# EasyEDA Pro project ProPrj_hdmi_3in1out_2024-07-09.epro

# Schematic SCH_hdmi_3in1out
Create Date: 2024-07-02; Page Name: P1; Project Name: hdmi_3in1out; Schematic Name: SCH_hdmi_3in1out; Update Date: 2024-07-04; Company: 8144623A; Page Size: A3
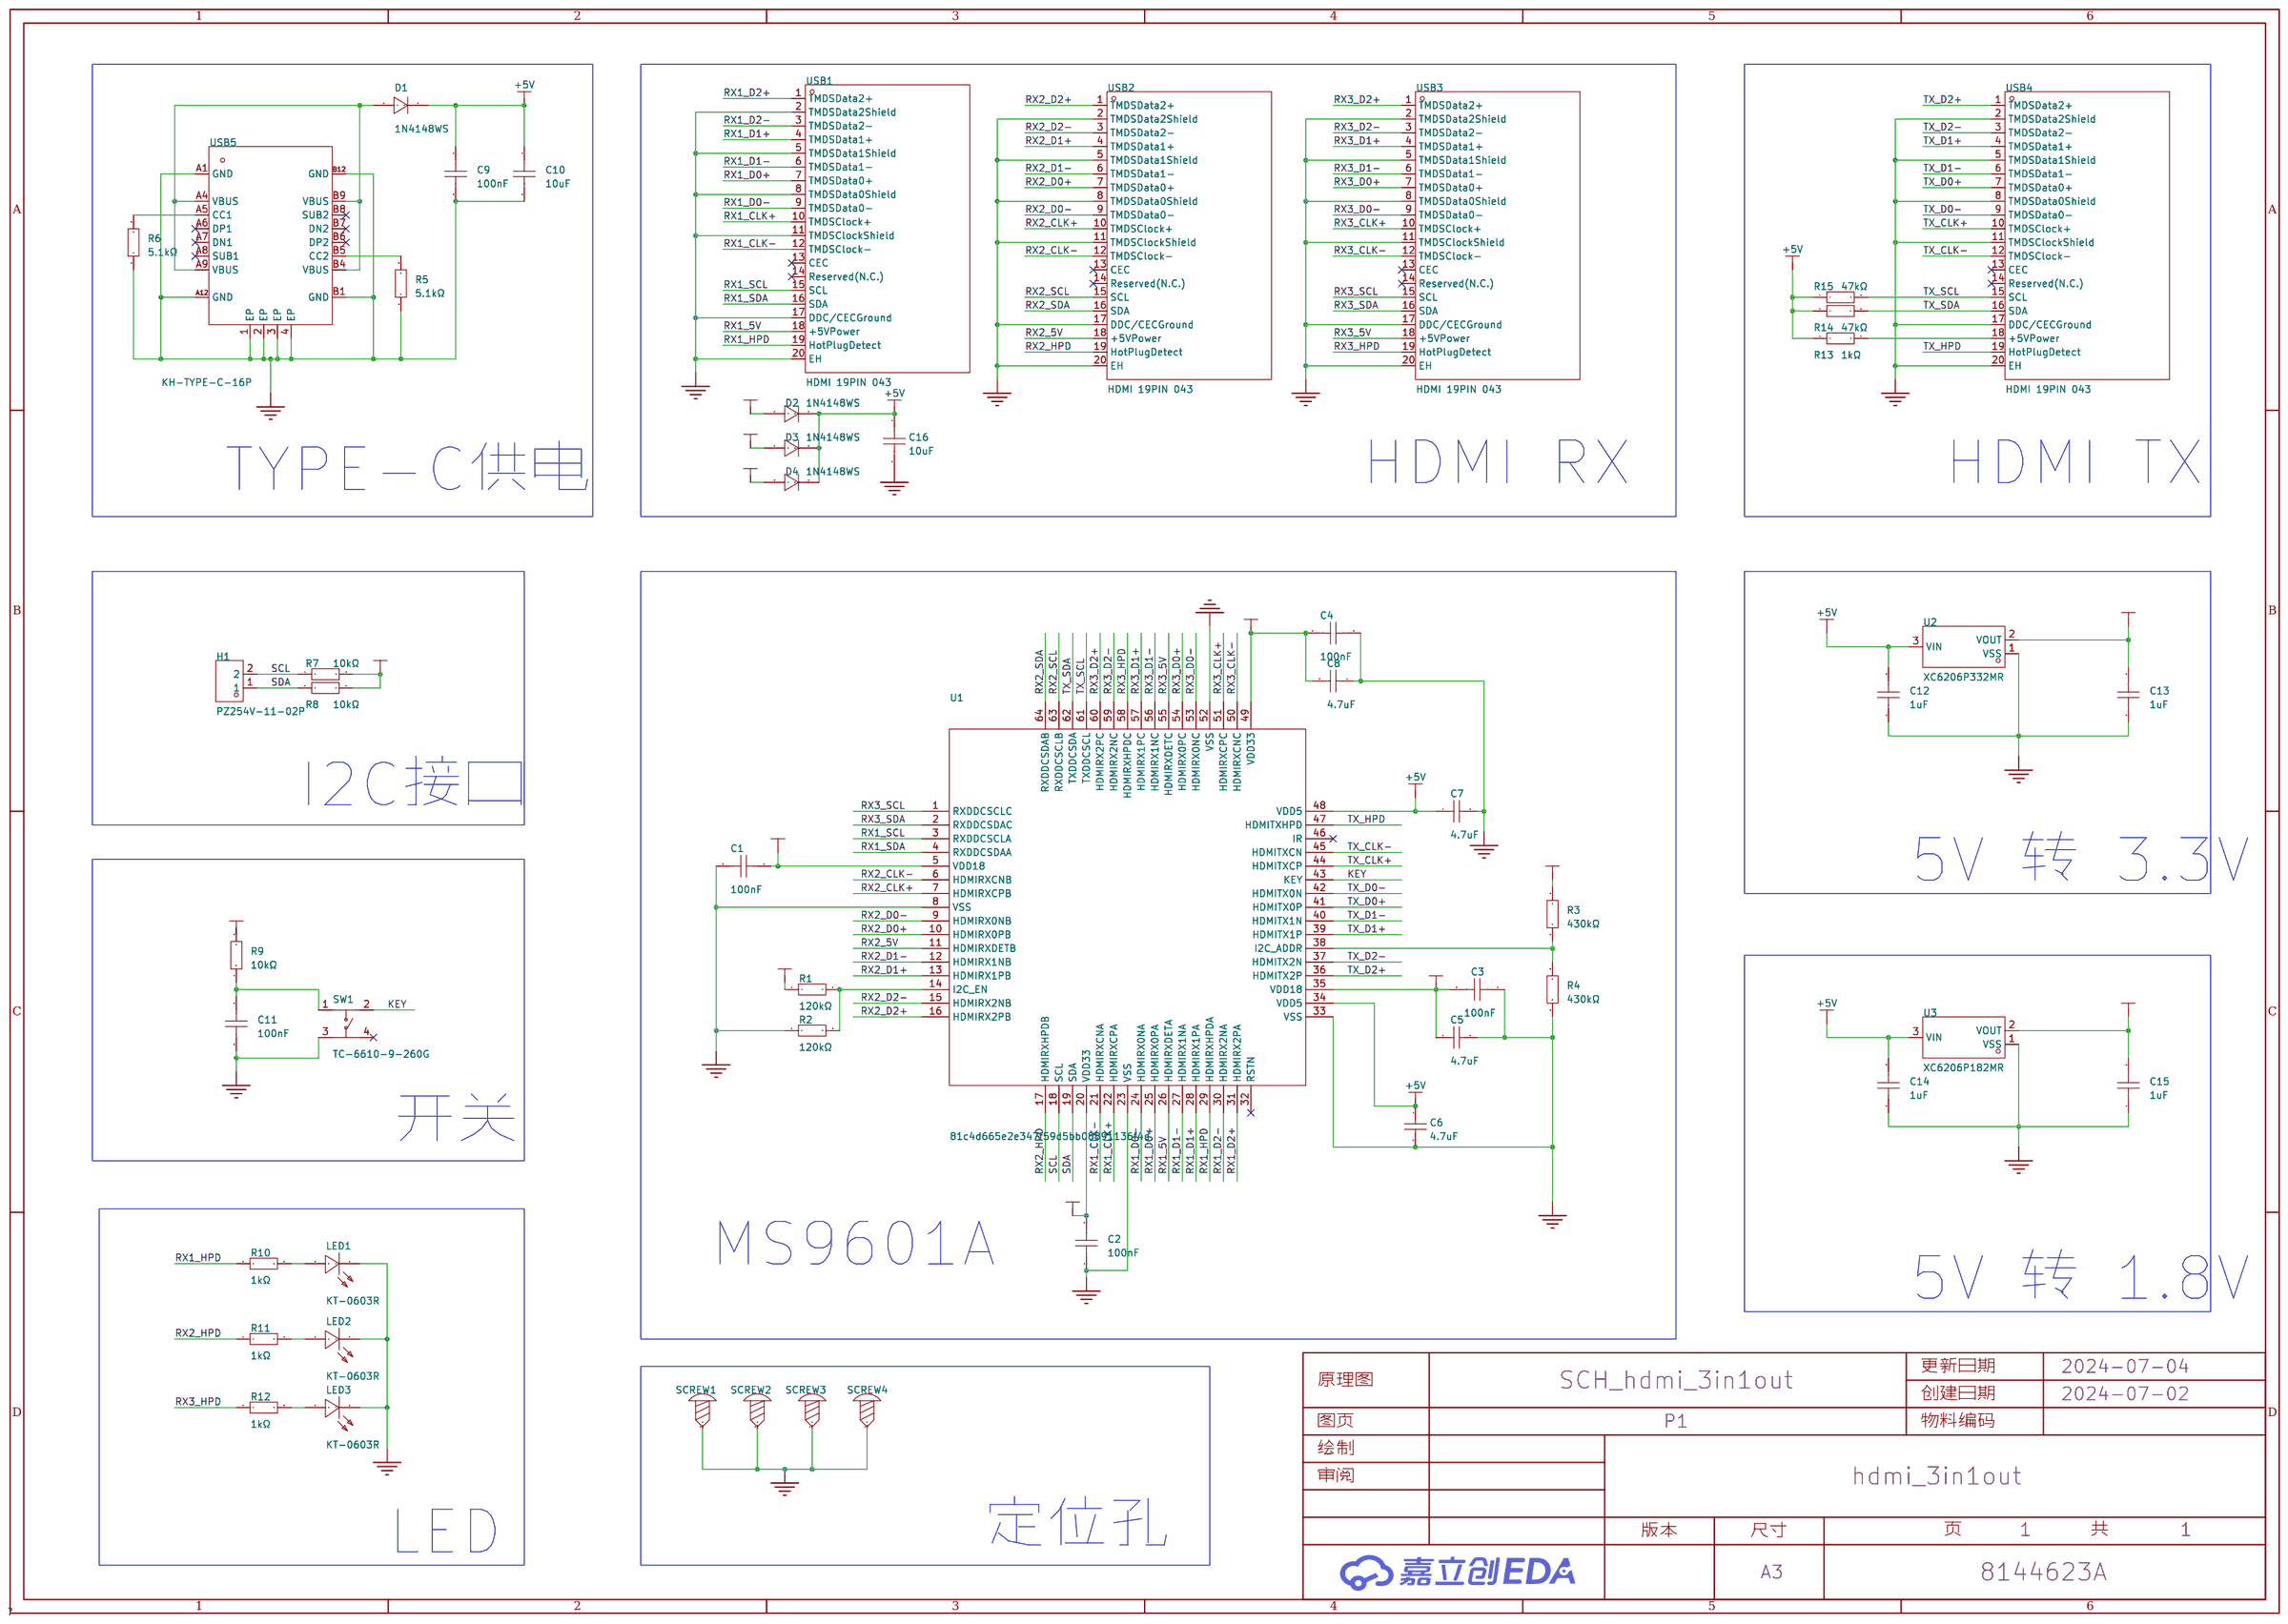
[diagram p0: schematic sheet]

## Parts
C1  100nF  [C0603]
C2  100nF  [C0603]
C3  100nF  [C0603]
C4  100nF  [C0603]
C5  4.7uF  [C0603]
C6  4.7uF  [C0603]
C7  4.7uF  [C0603]
C8  4.7uF  [C0603]
C9  100nF  [C0603]
C10  10uF  [C0603]
C11  100nF  [C0603]
C12  1uF  [C0603]
C13  1uF  [C0603]
C14  1uF  [C0603]
C15  1uF  [C0603]
C16  10uF  [C0603]
D1  1N4148WS  [SOD-323_L1.8-W1.3-LS2.5-RD]
D2  1N4148WS  [SOD-323_L1.8-W1.3-LS2.5-RD]
D3  1N4148WS  [SOD-323_L1.8-W1.3-LS2.5-RD]
D4  1N4148WS  [SOD-323_L1.8-W1.3-LS2.5-RD]
H1  PZ254V-11-02P  [HDR-TH_2P-P2.54-V-M]
LED1  KT-0603R  [LED0603-RD]
LED2  KT-0603R  [LED0603-RD]
LED3  KT-0603R  [LED0603-RD]
R1  120kΩ  [R0603]
R2  120kΩ  [R0603]
R3  430kΩ  [R0603]
R4  430kΩ  [R0603]
R5  5.1kΩ  [R0603]
R6  5.1kΩ  [R0603]
R7  10kΩ  [R0603]
R8  10kΩ  [R0603]
R9  10kΩ  [R0603]
R10  1kΩ  [R0603]
R11  1kΩ  [R0603]
R12  1kΩ  [R0603]
R13  1kΩ  [R0603]
R14  47kΩ  [R0603]
R15  47kΩ  [R0603]
SCREW1  -  [M3螺丝]
SCREW2  -  [M3螺丝]
SCREW3  -  [M3螺丝]
SCREW4  -  [M3螺丝]
SW1  TC-6610-9-260G  [SW-TH_4P-L5.0-W5.0-P4.50-LS6.5]
U1  81c4d665e2e347f59d5bb08891136f4d  [LQFP-64_L10.0-W10.0-P0.50-LS12.0-TL]
U2  XC6206P332MR  [SOT-23-3_L3.0-W1.7-P0.95-LS2.9-BR]
U3  XC6206P182MR  [SOT-23-3_L3.0-W1.7-P0.95-LS2.9-BR]
USB1  HDMI 19PIN 043  [HDMI-SMD_HDMI-19PIN-043]
USB2  HDMI 19PIN 043  [HDMI-SMD_HDMI-19PIN-043]
USB3  HDMI 19PIN 043  [HDMI-SMD_HDMI-19PIN-043]
USB4  HDMI 19PIN 043  [HDMI-SMD_HDMI-19PIN-043]
USB5  KH-TYPE-C-16P  [USB-C-SMD_KH-TYPE-C-16P]

## Library data of the parts
C1-C4 C9 C11 = CC0603KRX7R9BB104: 容值:100nF;精度:±10%;额定电压:50V;材质(温度系数):X7R;; LCSC Part Name: 100nF ±10% 50V; Supplier Part: C14663; Manufacturer: YAGEO(国巨); Supplier Footprint: 0603; JLCPCB Part Class: 基础库; Datasheet: https://atta.szlcsc.com/upload/public/pdf/source/20180910/C282072_33301C7F631E79921B82A8DAC6BCC5B3.pdf; Supplier: LCSC; Tolerance: ±10%; Voltage Rated: 50V; Temperature Coefficient: X7R
C5-C8 = CL10A475KO8NNNC: 容值:4.7uF;精度:±10%;额定电压:16V;材质(温度系数):X5R;; LCSC Part Name: 4.7uF ±10% 16V; Supplier Part: C19666; Manufacturer: SAMSUNG(三星); Supplier Footprint: 0603; JLCPCB Part Class: 基础库; Datasheet: https://atta.szlcsc.com/upload/public/pdf/source/20160218/1457707763339.pdf; Supplier: LCSC; Tolerance: ±10%; Voltage Rated: 16V; Temperature Coefficient: X5R
C10 C16 = CL10A106KP8NNNC: 容值:10uF;精度:±10%;额定电压:10V;材质(温度系数):X5R;; LCSC Part Name: 10uF ±10% 10V; Supplier Part: C19702; Manufacturer: SAMSUNG(三星); Supplier Footprint: 0603; JLCPCB Part Class: 基础库; Datasheet: https://atta.szlcsc.com/upload/public/pdf/source/20160218/1457707763339.pdf; Supplier: LCSC; Tolerance: ±10%; Voltage Rated: 10V; Temperature Coefficient: X5R
C12-C15 = CL10A105KB8NNNC: 容值:1uF;精度:±10%;额定电压:50V;材质(温度系数):X5R;; LCSC Part Name: 1uF ±10% 50V; Supplier Part: C15849; Manufacturer: SAMSUNG(三星); Supplier Footprint: 0603; JLCPCB Part Class: 基础库; Datasheet: https://atta.szlcsc.com/upload/public/pdf/source/20160218/1457707763339.pdf; Supplier: LCSC; Tolerance: ±10%; Voltage Rated: 50V; Temperature Coefficient: X5R
D1-D4 = 1N4148WS_C2128: 二极管配置:独立式;正向压降(Vf):1.25V@150mA;直流反向耐压(Vr):100V;平均整流电流(Io):150mA;功率:200mW;反向恢复时间(trr):4ns;; LCSC Part Name: 电压:100V 电流:150mA; Supplier Part: C2128; Manufacturer: CJ(江苏长电/长晶); Supplier Footprint: SOD-323; JLCPCB Part Class: 基础库; Datasheet: https://atta.szlcsc.com/upload/public/pdf/source/20140809/1457707208178.pdf; Supplier: LCSC; Diode Configuration: 独立式; Forward Voltage (Vf@If): 1.25V@150mA; Reverse Voltage (Vr): 100V; Average Rectified Current (Io): 150mA; Power Dissipation: 200mW; Reverse Leakage Current: 1uA@75V; Reverse Recovery Time (trr): 4ns
H1 = PZ254V-11-02P: 插针结构:1x2P;间距:2.54mm;行距:-;圆针/方针:方针;安装类型:直插;排数:单排;总PIN位数:2P;额定电流:-;额定电压:-;配合针长度:6mm;塑高:2.5mm;端接针长度:3mm;触头材质:黄铜;触头镀层:-;工作温度范围:-40℃~+105℃;颜色:黑色;; LCSC Part Name: 间距:2.54mm 1x2P 直插 方针; Supplier Part: C492401; Manufacturer: XFCN(兴飞); Supplier Footprint: 插件,P=2.54mm; JLCPCB Part Class: 扩展库; Datasheet: https://atta.szlcsc.com/upload/public/pdf/source/20200309/C492401_A812433581A9B211A7FFA413ADDFF0E5.pdf; Supplier: LCSC; Pin Structure: 1x2P; Pitch: 2.54mm; Circluar Pins/Square Pins: 方针; Mounting Type: 直插; Number of Rows: 单排; Number of Pins: 2P; Length of Mating Pin: 6mm; Insulation Height: 2.5mm; Length of End Connection Pin: 3mm; Contact Material: 黄铜; Operating Temperature Range: -40℃~+105℃; Color: 黑色
LED1-LED3 = KT-0603R: 发光颜色:红色;功率:-;正向电流:-;主波长:-;二极管配置:-;透镜颜色:-;色温:-;发光角度:-;载带方式:-;工作温度:-40℃~+85℃;; LCSC Part Name: 0603 红灯 高亮; Supplier Part: C2286; Manufacturer: KENTO; Supplier Footprint: 0603; JLCPCB Part Class: 基础库; Datasheet: https://atta.szlcsc.com/upload/public/pdf/source/20160616/1466072038404.pdf; Supplier: LCSC; Emitted Color: 红色; Operating Temperature: -40℃~+85℃
R1 R2 = 0603WAF1203T5E: 电阻类型:厚膜电阻;阻值:120kΩ;精度:±1%;功率:100mW;最大工作电压:75V;温度系数:±100ppm/℃;; LCSC Part Name: 120kΩ ±1% 100mW 厚膜电阻; Supplier Part: C25808; Manufacturer: UNI-ROYAL(厚声); Supplier Footprint: 0603; JLCPCB Part Class: 基础库; Datasheet: https://atta.szlcsc.com/upload/public/pdf/source/20200306/C422600_1E6D84923E4A46A82E41ADD87F860B5C.pdf; Supplier: LCSC; Type: 厚膜电阻; Tolerance: ±1%; Power(Watts): 100mW; Overload Voltage (Max): 75V; Temperature Coefficient: ±100ppm/℃; Operating Temperature Range: -55℃~+155℃
R3 R4 = AC0603FR-07430KL: 电阻类型:厚膜电阻;阻值:430kΩ;精度:±1%;功率:100mW;最大工作电压:75V;温度系数:±100ppm/℃;; LCSC Part Name: 厚膜电阻 430kΩ ±1% 100mW; Supplier Part: C227898; Manufacturer: YAGEO(国巨); Supplier Footprint: 0603; JLCPCB Part Class: 扩展库; Datasheet: https://atta.szlcsc.com/upload/public/pdf/source/20190107/C227898_FC1AF90E076E0DD6993EF8ADE20BB417.pdf; Supplier: LCSC; Type: 厚膜电阻; Tolerance: ±1%; Power(Watts): 100mW; Overload Voltage (Max): 75V; Temperature Coefficient: ±100ppm/℃; Operating Temperature Range: -55℃~+155℃
R5 R6 = 0603WAF5101T5E: 电阻类型:厚膜电阻;阻值:5.1kΩ;精度:±1%;功率:100mW;最大工作电压:75V;温度系数:±100ppm/℃;; LCSC Part Name: 5.1kΩ ±1% 100mW 厚膜电阻; Supplier Part: C23186; Manufacturer: UNI-ROYAL(厚声); Supplier Footprint: 0603; JLCPCB Part Class: 基础库; Datasheet: https://atta.szlcsc.com/upload/public/pdf/source/20200306/C422600_1E6D84923E4A46A82E41ADD87F860B5C.pdf; Supplier: LCSC; Type: 厚膜电阻; Tolerance: ±1%; Power(Watts): 100mW; Overload Voltage (Max): 75V; Temperature Coefficient: ±100ppm/℃; Operating Temperature Range: -55℃~+155℃
R7-R9 = 0603WAF1002T5E: 电阻类型:厚膜电阻;阻值:10kΩ;精度:±1%;功率:100mW;最大工作电压:75V;温度系数:±100ppm/℃;; LCSC Part Name: 厚膜电阻 10kΩ ±1% 100mW; Supplier Part: C25804; Manufacturer: UNI-ROYAL(厚声); Supplier Footprint: 0603; JLCPCB Part Class: 基础库; Datasheet: https://atta.szlcsc.com/upload/public/pdf/source/20200306/C422600_1E6D84923E4A46A82E41ADD87F860B5C.pdf; Supplier: LCSC; Type: 厚膜电阻; Tolerance: ±1%; Power(Watts): 100mW; Overload Voltage (Max): 75V; Temperature Coefficient: ±100ppm/℃; Operating Temperature Range: -55℃~+155℃
R10-R13 = 0603WAF1001T5E: 电阻类型:厚膜电阻;阻值:1kΩ;精度:±1%;功率:100mW;最大工作电压:75V;温度系数:±100ppm/℃;; LCSC Part Name: 1kΩ ±1% 100mW 厚膜电阻; Supplier Part: C21190; Manufacturer: UNI-ROYAL(厚声); Supplier Footprint: 0603; JLCPCB Part Class: 基础库; Datasheet: https://atta.szlcsc.com/upload/public/pdf/source/20200306/C422600_1E6D84923E4A46A82E41ADD87F860B5C.pdf; Supplier: LCSC; Type: 厚膜电阻; Tolerance: ±1%; Power(Watts): 100mW; Overload Voltage (Max): 75V; Temperature Coefficient: ±100ppm/℃; Operating Temperature Range: -55℃~+155℃
R14 R15 = 0603WAF4702T5E: 电阻类型:厚膜电阻;阻值:47kΩ;精度:±1%;功率:100mW;最大工作电压:75V;温度系数:±100ppm/℃;; LCSC Part Name: 47kΩ ±1% 100mW 厚膜电阻; Supplier Part: C25819; Manufacturer: UNI-ROYAL(厚声); Supplier Footprint: 0603; JLCPCB Part Class: 基础库; Datasheet: https://atta.szlcsc.com/upload/public/pdf/source/20200306/C422600_1E6D84923E4A46A82E41ADD87F860B5C.pdf; Supplier: LCSC; Type: 厚膜电阻; Tolerance: ±1%; Power(Watts): 100mW; Overload Voltage (Max): 75V; Temperature Coefficient: ±100ppm/℃; Operating Temperature Range: -55℃~+155℃
SCREW1-SCREW4 = M3螺丝: Supplier Footprint: 插件
SW1 = TC-6610-9-260G: 电路结构:单刀单掷;按钮形状:-;作用力:260gf;安装方式:直插;开关长度:6mm;开关宽度:6mm;开关高度:9mm;带支架:-;触点电流:50mA;额定电压(AC):-;额定电压(DC):12V;额定功率:-;绝缘电阻:100MΩ;带灯:-;机械寿命:10万次;; LCSC Part Name: 6*6*9mm 立贴 轻触开关; Supplier Part: C2845257; Manufacturer: HCTL(华灿天禄); Supplier Footprint: 插件; JLCPCB Part Class: 扩展库; Datasheet: https://atta.szlcsc.com/upload/public/pdf/source/20230323/2FDB5D6FCE87B7593CD3E5FAC75F65D7.pdf; Supplier: LCSC; Circuit: 单刀单掷; Operating Force: 260gf; Mounting Style: 直插; Switch Length: 6mm; Switch Width: 6mm; Switch Height: 9mm; Contact Current: 50mA; Voltage Rating (DC): 12V; Insulation Resistance: 100MΩ; Mechanical Life: 10万次
U1 = MS9601A
U2 = XC6206P332MR_C347376: 输出类型:固定;最大输入电压:8V;输出电压:3.3V;最大输出电流:250mA;电源纹波抑制比(PSRR):40dB@(1kHz);输出极性:正极;; LCSC Part Name: 输入8V 输出3.3V 250mA; Supplier Part: C347376; Manufacturer: UMW(友台半导体); Supplier Footprint: SOT-23; JLCPCB Part Class: 扩展库; Datasheet: https://atta.szlcsc.com/upload/public/pdf/source/20231109/6B10DA60E52FC900BF97E3EFEB5D6341.pdf; Supplier: LCSC; Output Type: 固定; Maximum Input Voltage: 8V; Output Voltage: 3.3V; MAX Output Current: 250mA; Power Supply Rejection Ratio (PSRR): 40dB@(1kHz); Dropout Voltage: 240mV@(50mA); Operating Temperature: -25℃~+80℃; Output Polarity: 正极; Number of Outputs: 1
U3 = XC6206P182MR_C347373: 输出类型:固定;最大输入电压:8V;输出电压:1.8V;最大输出电流:250mA;电源纹波抑制比(PSRR):40dB@(1kHz);输出极性:正极;; LCSC Part Name: 输入8V 输出1.8V 250mA; Supplier Part: C347373; Manufacturer: UMW(友台半导体); Supplier Footprint: SOT-23; JLCPCB Part Class: 扩展库; Datasheet: https://atta.szlcsc.com/upload/public/pdf/source/20231109/6B10DA60E52FC900BF97E3EFEB5D6341.pdf; Supplier: LCSC; Output Type: 固定; Maximum Input Voltage: 8V; Output Voltage: 1.8V; MAX Output Current: 250mA; Power Supply Rejection Ratio (PSRR): 40dB@(1kHz); Dropout Voltage: 280mV@(50mA); Output Polarity: 正极; Number of Outputs: 1
USB1-USB4 = HDMI 19PIN 043: 连接器类型:HDMI;公母:母;总PIN位数:19P;安装方式:卧贴;排数:-;额定电流:300mA;工作温度范围:-55℃~+85℃;; LCSC Part Name: HDMI 母 P数:19P; Supplier Part: C2858275; Manufacturer: SHOU HAN(首韩); Supplier Footprint: SMD; JLCPCB Part Class: 扩展库; Datasheet: https://atta.szlcsc.com/upload/public/pdf/source/20210728/C2858275_DF299413048A9CF092C2A61AB97004F4.pdf; Supplier: LCSC; Connector Type: HDMI; Gender: 母; Number of Pins: 19P; Mounting Style: 卧贴; Current Rating (Max): 300mA; Operating Temperature Range: -55℃~+85℃
USB5 = KH-TYPE-C-16P: 连接器类型:Type-C;标准:-;公母:母;端口数量:1;触点数量:16P;安装方式:卧贴;额定电流 - 电源:3A;工作温度范围:-40℃~+85℃;; LCSC Part Name: Type-C 母 卧贴; Supplier Part: C709357; Manufacturer: kinghelm(金航标); Supplier Footprint: SMD; JLCPCB Part Class: 扩展库; Datasheet: https://atta.szlcsc.com/upload/public/pdf/source/20200911/C709357_AA8DCEB38BB20E3035A7ED7AE7667837.pdf; Supplier: LCSC; Connector Type: Type-C; Gender: 母; Number of Ports: 1; Number of Contacts: 16P; Mounting Style: 卧贴; Current Rating - Power (Max): 3A; Operating Temperature Range: -40℃~+85℃

## Nets
1.8V: C1.1 C3.2 C5.1 C15.2 U1.5(VDD18) U1.35(VDD18) U3.2(VOUT)
3.3V: C2.2 C4.1 C8.2 C13.2 R1.1 R3.2 R7.2 R8.2 R9.2 U1.20(VDD33) U1.49(VDD33) U2.2(VOUT)
+5V: C6.1 C7.1 C9.1 C10.1 C12.2 C14.2 C16.1 D1.1(K) D2.1(K) D3.1(K) D4.1(K) R13.1 R14.1 R15.1 U1.34(VDD5) U1.48(VDD5) U2.3(VIN) U3.3(VIN)
GND: C1.2 C2.1 C3.1 C4.2 C5.2 C6.2 C7.2 C8.1 C9.2 C10.2 C11.2 C12.1 C13.1 C14.1 C15.1 C16.2 LED1.1(K) LED2.1(K) LED3.1(K) R2.1 R4.1 R5.1 R6.1 SCREW1.1 SCREW2.1 SCREW3.1 SCREW4.1 SW1.3 U1.8(VSS) U1.23(VSS) U1.33(VSS) U1.52(VSS) U2.1(VSS) U3.1(VSS) USB1.2(TMDSData2Shield) USB1.5(TMDSData1Shield) USB1.8(TMDSData0Shield) USB1.11(TMDSClockShield) USB1.17(DDC/CECGround) USB1.20(EH) USB2.2(TMDSData2Shield) USB2.5(TMDSData1Shield) USB2.8(TMDSData0Shield) USB2.11(TMDSClockShield) USB2.17(DDC/CECGround) USB2.20(EH) USB3.2(TMDSData2Shield) USB3.5(TMDSData1Shield) USB3.8(TMDSData0Shield) USB3.11(TMDSClockShield) USB3.17(DDC/CECGround) USB3.20(EH) USB4.2(TMDSData2Shield) USB4.5(TMDSData1Shield) USB4.8(TMDSData0Shield) USB4.11(TMDSClockShield) USB4.17(DDC/CECGround) USB4.20(EH) USB5.1(EP) USB5.2(EP) USB5.3(EP) USB5.4(EP) USB5.A1(GND) USB5.A12(GND) USB5.B1(GND) USB5.B12(GND)
KEY: SW1.2 U1.43(KEY)
RX1_5V: D2.2(A) U1.26(HDMIRXDETA) USB1.18(+5VPower)
RX1_CLK+: U1.22(HDMIRXCPA) USB1.10(TMDSClock+)
RX1_CLK-: U1.21(HDMIRXCNA) USB1.12(TMDSClock-)
RX1_D0+: U1.25(HDMIRX0PA) USB1.7(TMDSData0+)
RX1_D0-: U1.24(HDMIRX0NA) USB1.9(TMDSData0-)
RX1_D1+: U1.28(HDMIRX1PA) USB1.4(TMDSData1+)
RX1_D1-: U1.27(HDMIRX1NA) USB1.6(TMDSData1-)
RX1_D2+: U1.31(HDMIRX2PA) USB1.1(TMDSData2+)
RX1_D2-: U1.30(HDMIRX2NA) USB1.3(TMDSData2-)
RX1_HPD: R10.1 U1.29(HDMIRXHPDA) USB1.19(HotPlugDetect)
RX1_SCL: U1.3(RXDDCSCLA) USB1.15(SCL)
RX1_SDA: U1.4(RXDDCSDAA) USB1.16(SDA)
RX2_5V: D3.2(A) U1.11(HDMIRXDETB) USB2.18(+5VPower)
RX2_CLK+: U1.7(HDMIRXCPB) USB2.10(TMDSClock+)
RX2_CLK-: U1.6(HDMIRXCNB) USB2.12(TMDSClock-)
RX2_D0+: U1.10(HDMIRX0PB) USB2.7(TMDSData0+)
RX2_D0-: U1.9(HDMIRX0NB) USB2.9(TMDSData0-)
RX2_D1+: U1.13(HDMIRX1PB) USB2.4(TMDSData1+)
RX2_D1-: U1.12(HDMIRX1NB) USB2.6(TMDSData1-)
RX2_D2+: U1.16(HDMIRX2PB) USB2.1(TMDSData2+)
RX2_D2-: U1.15(HDMIRX2NB) USB2.3(TMDSData2-)
RX2_HPD: R11.1 U1.17(HDMIRXHPDB) USB2.19(HotPlugDetect)
RX2_SCL: U1.63(RXDDCSCLB) USB2.15(SCL)
RX2_SDA: U1.64(RXDDCSDAB) USB2.16(SDA)
RX3_5V: D4.2(A) U1.55(HDMIRXDETC) USB3.18(+5VPower)
RX3_CLK+: U1.51(HDMIRXCPC) USB3.10(TMDSClock+)
RX3_CLK-: U1.50(HDMIRXCNC) USB3.12(TMDSClock-)
RX3_D0+: U1.54(HDMIRX0PC) USB3.7(TMDSData0+)
RX3_D0-: U1.53(HDMIRX0NC) USB3.9(TMDSData0-)
RX3_D1+: U1.57(HDMIRX1PC) USB3.4(TMDSData1+)
RX3_D1-: U1.56(HDMIRX1NC) USB3.6(TMDSData1-)
RX3_D2+: U1.60(HDMIRX2PC) USB3.1(TMDSData2+)
RX3_D2-: U1.59(HDMIRX2NC) USB3.3(TMDSData2-)
RX3_HPD: R12.1 U1.58(HDMIRXHPDC) USB3.19(HotPlugDetect)
RX3_SCL: U1.1(RXDDCSCLC) USB3.15(SCL)
RX3_SDA: U1.2(RXDDCSDAC) USB3.16(SDA)
SCL: H1.2 R7.1 U1.18(SCL)
SDA: H1.1 R8.1 U1.19(SDA)
TX_CLK+: U1.44(HDMITXCP) USB4.10(TMDSClock+)
TX_CLK-: U1.45(HDMITXCN) USB4.12(TMDSClock-)
TX_D0+: U1.41(HDMITX0P) USB4.7(TMDSData0+)
TX_D0-: U1.42(HDMITX0N) USB4.9(TMDSData0-)
TX_D1+: U1.39(HDMITX1P) USB4.4(TMDSData1+)
TX_D1-: U1.40(HDMITX1N) USB4.6(TMDSData1-)
TX_D2+: U1.36(HDMITX2P) USB4.1(TMDSData2+)
TX_D2-: U1.37(HDMITX2N) USB4.3(TMDSData2-)
TX_HPD: U1.47(HDMITXHPD) USB4.19(HotPlugDetect)
TX_SCL: R15.2 U1.61(TXDDCSCL) USB4.15(SCL)
TX_SDA: R14.2 U1.62(TXDDCSDA) USB4.16(SDA)
$1N1487: R1.2 R2.2 U1.14(I2C_EN)
$1N1687: R3.1 R4.2 U1.38(I2C_ADDR)
$1N4048: R5.2 USB5.B5(CC2)
$1N4076: R6.2 USB5.A5(CC1)
$1N4174: D1.2(A) USB5.A4(VBUS) USB5.A9(VBUS) USB5.B4(VBUS) USB5.B9(VBUS)
$1N5209: C11.1 R9.1 SW1.1
$1N5577: LED1.2(A) R10.2
$1N5615: LED3.2(A) R12.2
$1N5620: LED2.2(A) R11.2
$1N6792: R13.2 USB4.18(+5VPower)

Not connected (* = marked no-connect by the designer): SW1 4*; U1 32(RSTN)* 46(IR)*; USB1 13(CEC)* 14(Reserved(N.C.))*; USB2 13(CEC)* 14(Reserved(N.C.))*; USB3 13(CEC)* 14(Reserved(N.C.))*; USB4 13(CEC)* 14(Reserved(N.C.))*; USB5 A6(DP1)* A7(DN1)* A8(SUB1)* B6(DP2)* B7(DN2)* B8(SUB2)*

## Notes on the sheet
- TYPE-C供电
- HDMI RX
- HDMI TX
- I2C接口
- 5V 转 3.3V
- 开关
- MS9601A
- 5V 转 1.8V
- 定位孔
- LED

# Board PCB_hdmi_3in1out
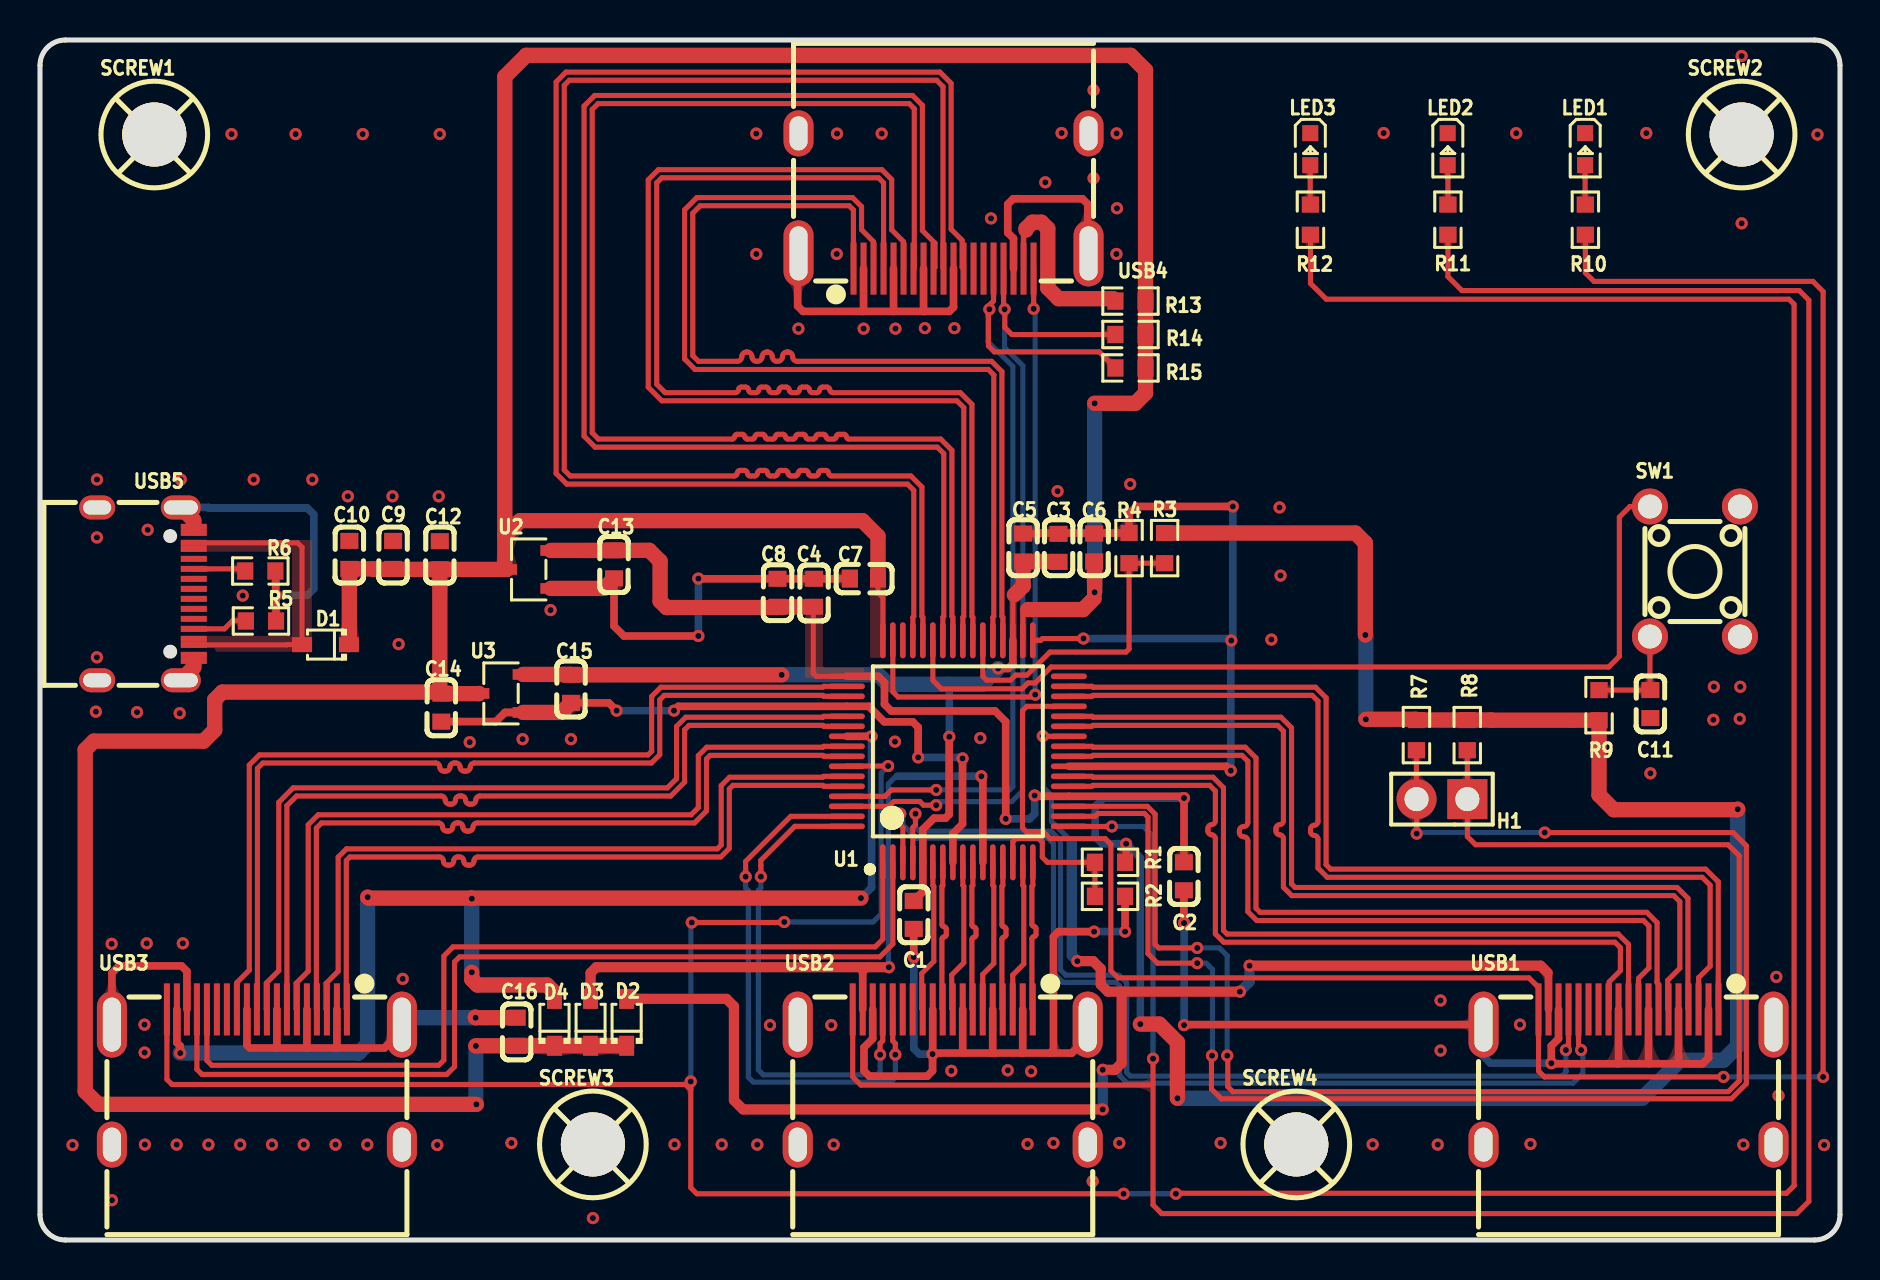
[diagram p1: board, top side]
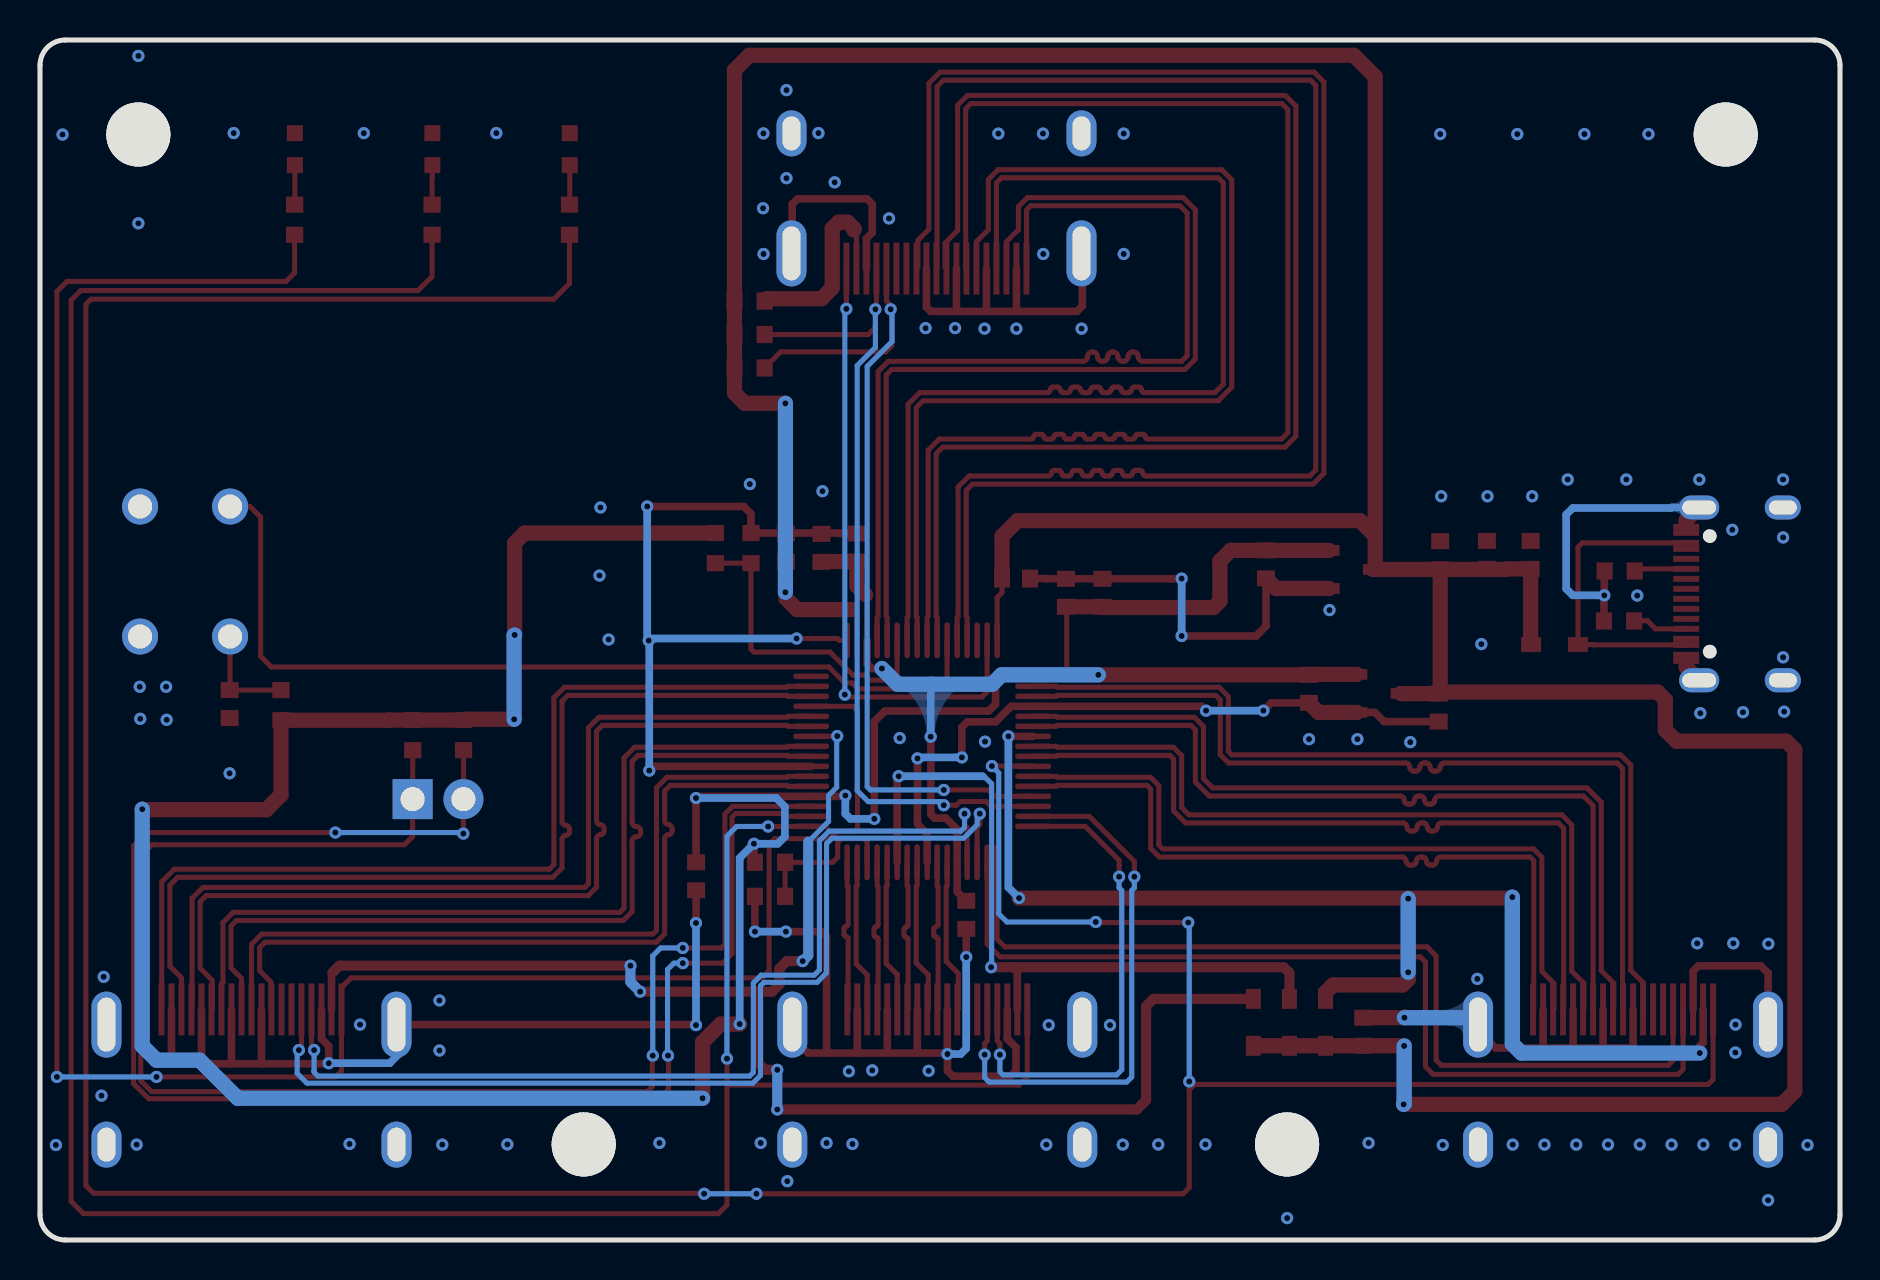
[diagram p2: board, bottom side, seen from below]

Outline 90 x 60 mm; copper layers: Top Layer, Bottom Layer. Coordinates in mm from the lower left corner of the outline.
Outline path: 0,58.73 0,1.27 arc(0.37,0.37) 1.27,0 88.73,0 arc(89.63,0.37) 90,1.27 90,58.73 arc(89.63,59.63) 88.73,60 1.27,60 arc(0.37,59.63) 0,58.73
Stack: Top Layer 0.035mm / Dielectric1 1.51mm FR4 er 4.5 / Bottom Layer 0.035mm

## Design rules (mm)
net RX3_D2+: DP9
net RX3_D2-: DP9
net RX3_D1+: DP10
net RX3_D1-: DP10
net RX3_D0+: DP11
net RX3_D0-: DP11
net RX3_CLK+: DP12
net RX3_CLK-: DP12
net TX_CLK-: DP13
net TX_CLK+: DP13
net TX_D0-: DP14
net TX_D0+: DP14
net TX_D1-: DP15
net TX_D1+: DP15
net TX_D2-: DP16
net TX_D2+: DP16
net RX1_D2+: DP8
net RX1_D2-: DP8
net RX1_D1+: DP7
net RX1_D1-: DP7
net RX1_D0+: DP6
net RX1_D0-: DP6
net RX1_CLK+: DP5
net RX1_CLK-: DP5
net RX2_D2+: DP2
net RX2_D2-: DP2
net RX2_D1+: DP3
net RX2_D1-: DP3
net RX2_D0+: DP4
net RX2_D0-: DP4
net RX2_CLK+: DP1
net RX2_CLK-: DP1
template: JLCPCB Capability(Two Layers Board)
spacing copperThickness1oz (default): track to track 0.102, other pairs 0.152 to 0.3
spacing copperThickness2oz: track to track 0.203, other pairs 0.152 to 0.3
track width copperThickness1oz (default): min 0.127, default 0.254, max 2.54
track width copperThickness2oz: min 0.203, default 0.254, max 2.54
differential pair differentialPair (default): width min 0.127, default 0.254, max 2.54; gap min 0.152, default 0.152
via viaSize (default): diameter min 0.5, default 0.61, max 10; hole min 0.3, default 0.305, max 6.3

## Placement (name value [footprint] x y rotation side)
C1  100nF  [C0603]  43.69 16.26 270 top
C2  100nF  [C0603]  57.2 18.19 90 top
C3  100nF  [C0603]  50.93 34.61 270 top
C4  100nF  [C0603]  38.7 32.36 90 top
C5  4.7uF  [C0603]  49.16 34.62 90 top
C6  4.7uF  [C0603]  52.71 34.62 90 top
C7  4.7uF  [C0603]  41.2 33.07 180 top
C8  4.7uF  [C0603]  36.88 32.36 270 top
C9  100nF  [C0603]  17.66 34.25 90 top
C10  10uF  [C0603]  15.47 34.25 90 top
C11  100nF  [C0603]  80.52 26.8 270 top
C12  1uF  [C0603]  19.99 34.24 270 top
C13  1uF  [C0603]  28.7 33.78 90 top
C14  1uF  [C0603]  20.07 26.62 90 top
C15  1uF  [C0603]  26.55 27.56 90 top
C16  10uF  [C0603]  23.84 10.41 90 top
D1  1N4148WS  [SOD-323_L1.8-W1.3-LS2.5-RD]  14.28 29.77 180 top
D2  1N4148WS  [SOD-323_L1.8-W1.3-LS2.5-RD]  29.33 10.88 90 top
D3  1N4148WS  [SOD-323_L1.8-W1.3-LS2.5-RD]  27.53 10.88 90 top
D4  1N4148WS  [SOD-323_L1.8-W1.3-LS2.5-RD]  25.72 10.88 90 top
H1  PZ254V-11-02P  [HDR-TH_2P-P2.54-V-M]  70.1 22.04 180 top
LED1  KT-0603R  [LED0603-RD]  77.26 54.54 270 top
LED2  KT-0603R  [LED0603-RD]  70.38 54.54 270 top
LED3  KT-0603R  [LED0603-RD]  63.51 54.54 270 top
R1  120kΩ  [R0603]  53.5 18.88 180 top
R2  120kΩ  [R0603]  53.5 17.18 180 top
R3  430kΩ  [R0603]  56.23 34.59 90 top
R4  430kΩ  [R0603]  54.45 34.59 270 top
R5  5.1kΩ  [R0603]  11.05 30.95 180 top
R6  5.1kΩ  [R0603]  11.02 33.45 180 top
R7  10kΩ  [R0603]  68.82 25.24 90 top
R8  10kΩ  [R0603]  71.36 25.24 90 top
R9  10kΩ  [R0603]  77.95 26.74 270 top
R10  1kΩ  [R0603]  77.27 51.02 90 top
R11  1kΩ  [R0603]  70.4 51.02 90 top
R12  1kΩ  [R0603]  63.52 51.02 90 top
R13  1kΩ  [R0603]  54.52 46.95 180 top
R14  47kΩ  [R0603]  54.52 45.27 180 top
R15  47kΩ  [R0603]  54.52 43.6 180 top
SCREW1  -  [M3螺丝]  5.78 55.21 0 top
SCREW2  -  [M3螺丝]  85.15 55.21 0 top
SCREW3  -  [M3螺丝]  27.71 4.72 0 top
SCREW4  -  [M3螺丝]  62.88 4.72 0 top
SW1  TC-6610-9-260G  [SW-TH_4P-L5.0-W5.0-P4.50-LS6.5]  82.75 33.42 90 top
U1  81c4d665e2e347f59d5bb08891136f4d  [LQFP-64_L10.0-W10.0-P0.50-LS12.0-TL]  45.89 24.43 90 top
U2  XC6206P332MR  [SOT-23-3_L3.0-W1.7-P0.95-LS2.9-BR]  24.44 33.53 0 top
U3  XC6206P182MR  [SOT-23-3_L3.0-W1.7-P0.95-LS2.9-BR]  23.05 27.33 0 top
USB1  HDMI 19PIN 043  [HDMI-SMD_HDMI-19PIN-043]  79.43 8.15 0 top
USB2  HDMI 19PIN 043  [HDMI-SMD_HDMI-19PIN-043]  45.14 8.15 0 top
USB3  HDMI 19PIN 043  [HDMI-SMD_HDMI-19PIN-043]  10.85 8.15 0 top
USB4  HDMI 19PIN 043  [HDMI-SMD_HDMI-19PIN-043]  45.18 51.95 180 top
USB5  KH-TYPE-C-16P  [USB-C-SMD_KH-TYPE-C-16P]  5.28 32.31 270 top

## Footprints (pads in the part's own frame, mm; a bottom-side part is the same pattern mirrored in y, then rotated)
C0603
  rect 0.8x0.9 smd: 1(-0.7,0) 2(0.7,0)
HDMI-SMD_HDMI-19PIN-043
  rect 0.3x2.6 smd: 1(4.5,3.38) 2(4,3.38) 3(3.5,3.38) 4(3,3.38) 5(2.5,3.38) 6(2,3.38) 7(1.5,3.38) 8(1,3.38) 9(0.5,3.38) 10(0,3.38) 11(-0.5,3.38) 12(-1,3.38) 13(-1.5,3.38) 14(-2,3.38) 15(-2.5,3.38) 16(-3,3.38) 17(-3.5,3.38) 18(-4,3.38) 19(-4.5,3.38)
  oval 1.5x3.3 hole 0.9x2.7: 20(-7.25,2.62) 20(7.25,2.62)
  oval 1.5x2.3 hole 0.9x1.7: 20(-7.25,-3.38) 20(7.25,-3.38)
HDR-TH_2P-P2.54-V-M
  rect 2x2 hole 1.2: 1(-1.27,0)
  round 2 hole 1.2: 2(1.27,0)
LED0603-RD
  rect 0.8x0.8 smd: 1(-0.799,0) 2(0.799,0)
LQFP-64_L10.0-W10.0-P0.50-LS12.0-TL
  oval 1.8x0.28 smd: 1(-5.55,3.75) 2(-5.55,3.25) 3(-5.55,2.75) 4(-5.55,2.25) 5(-5.55,1.75) 6(-5.55,1.25) 7(-5.55,0.75) 8(-5.55,0.25) 9(-5.55,-0.25) 10(-5.55,-0.75) 11(-5.55,-1.25) 12(-5.55,-1.75) 13(-5.55,-2.25) 14(-5.55,-2.75) 15(-5.55,-3.25) 16(-5.55,-3.75) 33(5.55,-3.75) 34(5.55,-3.25) 35(5.55,-2.75) 36(5.55,-2.25) 37(5.55,-1.75) 38(5.55,-1.25) 39(5.55,-0.75) 40(5.55,-0.25) 41(5.55,0.25) 42(5.55,0.75) 43(5.55,1.25) 44(5.55,1.75) 45(5.55,2.25) 46(5.55,2.75) 47(5.55,3.25) 48(5.55,3.75)
  oval 0.28x1.8 smd: 17(-3.75,-5.55) 18(-3.25,-5.55) 19(-2.75,-5.55) 20(-2.25,-5.55) 21(-1.75,-5.55) 22(-1.25,-5.55) 23(-0.75,-5.55) 24(-0.25,-5.55) 25(0.25,-5.55) 26(0.75,-5.55) 27(1.25,-5.55) 28(1.75,-5.55) 29(2.25,-5.55) 30(2.75,-5.55) 31(3.25,-5.55) 32(3.75,-5.55) 49(3.75,5.55) 50(3.25,5.55) 51(2.75,5.55) 52(2.25,5.55) 53(1.75,5.55) 54(1.25,5.55) 55(0.75,5.55) 56(0.25,5.55) 57(-0.25,5.55) 58(-0.75,5.55) 59(-1.25,5.55) 60(-1.75,5.55) 61(-2.25,5.55) 62(-2.75,5.55) 63(-3.25,5.55) 64(-3.75,5.55)
M3螺丝
  round 3.2 hole 3.2: 1(-0.064,0.064)
R0603
  rect 0.806x0.864 smd: 1(-0.753,0) 2(0.753,0)
SOD-323_L1.8-W1.3-LS2.5-RD
  rect 1x0.75 smd: 1(-1.173,0) 2(1.173,0)
SOT-23-3_L3.0-W1.7-P0.95-LS2.9-BR
  rect 1.038x0.532 smd: 1(1.101,-0.95) 2(1.101,0.95) 3(-1.101,0)
SW-TH_4P-L5.0-W5.0-P4.50-LS6.5
  round 1.8 hole 1.2: 1(-3.25,2.25) 2(3.25,2.25) 3(-3.25,-2.25) 4(3.25,-2.25)
USB-C-SMD_KH-TYPE-C-16P
  oval 1.2x2 hole 0.7x1.7: 1(-4.32,1.765) 2(4.32,1.765)
  oval 1.2x1.8 hole 0.7x1.4: 3(-4.32,-2.415) 4(4.32,-2.415)
  rect 0.3x1.3 smd: A1(-3.35,2.415) A4(-2.55,2.415) A5(-1.25,2.415) A6(-0.25,2.415) A7(0.25,2.415) A8(1.25,2.415) A9(2.55,2.415) A12(3.35,2.415) B1(3.05,2.415) B4(2.25,2.415) B5(1.75,2.415) B6(0.75,2.415) B7(-0.75,2.415) B8(-1.75,2.415) B9(-2.25,2.415) B12(-3.05,2.415)

## Nets
As in the schematic.

Pads without a net: SW1 4; U1 32 46; USB1 13 14; USB2 13 14; USB3 13 14; USB4 13 14; USB5 A6 A7 A8 B6 B7 B8

## Via types
v1: diameter 0.61, hole 0.305, Top Layer to Bottom Layer, 181 vias

## Routing (per net, layer and track width the routed paths; a pad name or vN(x,y) marks a point on that pad's centre or on a via; arc(x,y) is an arc through that point)
1.8V: length 44.1
  Top Layer w0.254: U1.35 48.64,32.18 48.72,32.26
  Top Layer w0.381: U1.35 48.64,28.81 48.41,28.58 v1(47.9,28.58) ; v1(45.47,25.16) 45.46,25.15 45.46,21.28 45.27,21.09 44.7,21.09 44.14,20.53 U1.5 44.14,17.41 C1.1
  Top Layer w0.762: 48.72,32.26 49.16,32.7 C5.1 50.91,33.92 C3.2 ; v1(37.08,28.26) C15.2 26.53,28.28 U3.2
  Bottom Layer w0.381: 45.44,27.79 45.47,27.76 v1(45.47,25.16)
  Bottom Layer w0.762: v1(37.08,28.26) 41.92,28.26 42.39,27.79 47.12,27.79 v1(47.9,28.58)
3.3V: length 154
  Top Layer w0.254: U1.49 38.82,28.18 38.66,28.34 38.66,31.62 C4.1
  Top Layer w0.381: C2.2 57.2,19.67 57.2,19.67 v1(57.2,22.1) 57.11,22.18 U1.20 49.77,22.18 v1(49.73,22.22) ; v1(54.31,19.81) 54.31,18.94 R1.1 ; U1.49 41.92,28.18 42.22,27.88 42.22,26.79 42.56,26.45 47.75,26.45 48.29,25.92 v1(48.29,21.06)
  Top Layer w0.762: v1(66.27,30.25) 66.27,34.85 65.77,35.35 R3.2 ; U2.2 28.7,34.48 C13.2 30.47,34.48 31,33.94 31,31.94 31.33,31.62 36.84,31.62 C8.2 C4.1 ; v1(56.87,7.09) 56.87,9.89 55.96,10.79 v1(55.02,10.79) ; v1(84.89,21.54) 84.86,21.51 78.69,21.51 77.95,22.25 R9.2 72.57,25.99 72.56,26 R8.2 R7.2 68.78,26.03 v1(66.29,26.03)
  Bottom Layer w0.381: v1(49.73,22.22) 49.73,21.31 49.48,21.06 v1(48.29,21.06) ; v1(57.2,22.1) 53.19,22.1 52.76,21.67 52.76,20.17 53.11,19.81 v1(54.31,19.81) 55.02,19.1 v1(55.02,10.79)
  Bottom Layer w0.762: v1(56.87,7.09) 80.11,7.09 82.02,8.99 84.18,8.99 84.89,9.7 v1(84.89,21.54) ; v1(66.29,26.03) 66.29,30.23 v1(66.27,30.25)
+5V: length 204.2
  Top Layer w0.254: U1.48 42.14,32.12 41.9,32.37 C7.1 ; U1.34 49.14,31.29 49.38,31.52
  Top Layer w0.762: v1(21.79,9.7) 21.8,9.71 23.84,9.71 ; D1.1 15.47,29.79 C10.1 16.68,33.55 16.71,33.53 19.99,33.53 ; v1(52.73,41.83) 54.76,41.83 55.28,42.35 55.28,58.49 54.53,59.23 24.31,59.23 23.24,58.17 23.24,35.2 ; v1(52.73,32.39) 52.73,33.9 C6.1 ; 23.24,35.2 23.24,33.62 U2.3 19.99,33.53 ; 23.24,35.2 24,35.97 41.12,35.97 41.9,35.19 C7.1 ; 23.84,9.71 C16.1 ; 23.84,9.71 29.33,9.71 ; v1(21.82,6.78) 2.91,6.78 2.26,7.43 2.26,24.51 2.69,24.94 8.18,24.94 8.73,25.5 8.73,27.01 9.12,27.4 19.99,27.4 ; 52.71,32.08 52.15,31.52 49.38,31.52 ; 19.99,33.53 C12.2 ; 19.99,33.53 19.99,27.4 ; 19.99,27.4 C14.2 21.94,27.32 U3.3
  Bottom Layer w0.762: v1(21.79,9.7) 21.79,6.81 v1(21.82,6.78) ; v1(52.73,41.83) v1(52.73,32.39)
GND: length 266.9
  Top Layer w0.254: v1(52.17,30.07) 50.13,30.07 50.04,29.98 U1.33
  Top Layer w0.381: USB3.20 3.6,13.35 3.95,13.71 7.08,13.71 7.35,13.44 USB3.17 ; 41.18,48.57 41.18,46.48 41.13,46.43 ; 44.2,46.43 44.18,46.45 44.18,48.57 ; 44.2,46.43 42.65,46.43 ; 44.2,46.43 45.47,46.43 45.68,46.64 USB4.11 ; USB4.20 52.39,49.37 52.39,51.79 52.12,52.06 48.66,52.06 48.39,51.79 48.39,50.37 48.68,50.08 USB4.17 ; v1(57.2,15.85) 57.2,15.86 C2.1 ; USB3.2 14.85,9.67 14.78,9.6 ; 46.18,9.35 47.59,9.35 ; 46.18,9.35 46.14,9.39 USB2.8 ; 46.18,9.35 44.68,9.35 44.64,9.3 USB2.11 ; 47.59,9.35 47.64,9.39 USB2.5 ; 47.59,9.35 49.07,9.35 ; 78.9,8.81 75.59,8.81 v1(75.56,8.84) 75.56,9.7 75.93,10.06 USB1.17 ; 78.9,8.81 78.93,8.84 USB1.11 ; 78.9,8.81 80.45,8.81 ; 81.91,8.81 80.45,8.81 ; 81.91,8.81 83.13,8.81 83.43,9.1 USB1.2 ; 81.91,8.81 81.93,8.82 USB1.5 ; 80.45,8.81 80.43,8.84 USB1.8 ; 50.51,9.35 50.67,9.51 50.67,15.16 50.93,15.42 v1(52.71,15.42) ; 50.51,9.35 49.07,9.35 ; 50.51,9.35 51.59,9.35 52.39,10.15 USB2.20 ; 49.07,9.35 49.14,9.41 USB2.2 ; v1(43.91,24.13) 43.91,25.64 43.64,25.91 42.22,25.91 41.44,26.68 U1.52 31.92,26.68 v1(31.7,26.47) ; 11.85,9.6 13.34,9.6 ; 11.85,9.6 11.85,9.6 USB3.8 ; 11.85,9.6 10.49,9.6 10.35,9.75 USB3.11 ; 13.34,9.6 14.78,9.6 ; 13.34,9.6 13.35,9.61 USB3.5 ; 14.78,9.6 17.22,9.6 18.1,10.48 USB3.20 ; 42.65,46.43 41.13,46.43 ; 42.65,46.43 42.68,46.46 USB4.5 ; 41.13,46.43 38.15,46.43 37.88,46.7 37.88,49.29 USB4.20 ; C1.2 v1(43.69,14.15) ; C7.2 39.72,33.07 39.71,33.06 C4.2 C8.1 32.93,33.06 v1(32.92,33.07) ; USB2.17 41.64,10.06 41.2,9.63 41.2,8.46 41.47,8.19 44.36,8.19 44.63,8.46 v1(44.63,9.3) ; v1(46.13,24.08) 46.13,20.8 45.64,20.32 U1.8 ; C13.1 28.7,30.69 29.2,30.2 v1(32.92,30.2) ; C14.1 22.79,25.92 23.25,26.38 24.15,26.38 ; R6.1 11.79,33.43 v1(11.79,32.23) 11.8,32.22 R5.1 ; v1(57.2,10.74) 57.23,10.77 USB1.20 ; v1(59.64,36.68) 54.81,36.68 54.45,36.32 R4.1 50.01,35.35 49.99,35.32 C5.2 ; C15.1 28.44,26.86 v1(28.83,26.47) ; U1.23 59.32,23.68 v1(59.54,23.47) ; R2.1 v1(54.25,15.42)
  Top Layer w0.762: USB5.A12 7.69,28.64 USB5.2 ; USB5.A1 7.69,35.98 USB5.1 ; C13.1 28.2,32.58 U2.1 ; C16.2 v1(21.78,11.11) 21.77,11.12 21.77,11.15 ; 24.15,26.38 26.07,26.38 C15.1
  Bottom Layer w0.381: v1(57.2,15.85) v1(57.2,10.74) ; v1(59.56,29.97) 59.54,29.95 v1(59.54,23.47) ; v1(59.56,29.97) 59.64,30.05 v1(59.64,36.68) ; v1(59.56,29.97) 59.46,30.07 v1(52.17,30.07) ; v1(46.13,24.08) 46.08,24.13 v1(43.91,24.13) ; USB1.20 72.09,10.69 72.09,9.26 72.52,8.84 v1(75.56,8.84) ; v1(54.25,15.42) v1(52.71,15.42) ; v1(44.63,9.3) 43.97,9.3 43.69,9.58 v1(43.69,14.15) ; v1(32.92,33.07) v1(32.92,30.2) ; v1(31.7,26.47) v1(28.83,26.47) ; v1(11.79,32.23) 13.36,32.23 13.69,32.56 13.69,36.27 13.36,36.6 8.45,36.6 8.42,36.63 USB5.1
  Bottom Layer w0.762: USB3.20 18.44,11.11 v1(21.78,11.11)
  vias: v1(1.63,4.75) v1(2.85,38.02) v1(2.84,35.13) v1(2.84,29.13) v1(2.79,26.42) v1(3.58,14.81) v1(3.6,1.99) v1(4.85,26.39) v1(5.22,10.77) v1(5.23,9.37) v1(5.25,4.77) v1(5.33,14.83) v1(5.39,35.51) v1(6.83,4.77) v1(7.04,38.02) v1(6.98,26.34) v1(7.14,14.83) v1(8.42,4.77) v1(9.58,55.3) v1(10.01,4.77) v1(10.14,32.22) v1(10.69,38.02) v1(11.6,4.77) v1(12.78,55.3) v1(13.19,4.77) v1(13.61,38.02) v1(14.78,4.77) v1(15.39,37.19) v1(16.14,55.3) v1(16.36,4.77) v1(17.63,37.19) v1(17.93,29.79) v1(18.14,13.06) v1(19.94,37.19) v1(19.86,4.75) v1(19.99,55.3) v1(21.49,24.89) v1(23.57,4.85) v1(24.13,25.04) v1(25.53,31.5) v1(26.55,25.04) v1(27.64,1.1) v1(31.73,4.78) v1(34.09,4.78) v1(35.81,55.32) v1(35.81,49.3) v1(35.86,4.77) v1(36.5,10.74) v1(37.92,45.57) v1(39.56,10.74) v1(39.68,4.77) v1(39.84,49.3) v1(39.85,55.32) v1(41.18,45.57) v1(42.08,55.32) v1(42.75,24.92) v1(42.77,45.57) v1(44.25,45.59) v1(45.57,8.46) v1(45.72,45.59) v1(47.02,25.09) v1(47.55,51.08) v1(48.39,8.48) v1(49.38,4.8) v1(49.56,8.43) v1(50.27,52.88) v1(50.67,4.85) v1(50.88,37.44) v1(51.08,55.35) v1(52.64,2.94) v1(52.68,57.49) v1(52.68,53.09) v1(53.83,55.33) v1(53.85,51.59) v1(53.82,49.3) v1(53.97,4.85) v1(54.51,37.8) v1(59.03,4.85) v1(61.57,30.02) v1(61.98,36.63) v1(62.03,33.22) v1(66.63,4.78) v1(67.18,55.35) v1(69.89,4.77) v1(70.03,11.98) v1(70.03,9.47) v1(73.81,55.34) v1(74,10.77) v1(74.52,4.8) v1(80.31,55.35) v1(80.52,23.34) v1(83.69,27.66) v1(83.67,26.01) v1(85.01,27.66) v1(84.99,26.06) v1(85.08,59.2) v1(85.08,50.83) v1(85.17,4.77) v1(86.82,13.16) v1(86.93,7.22) v1(88.87,55.27) v1(89.21,4.75)
KEY: length 45.9
  Top Layer w0.254: U1.43 44.64,27.98 45.07,27.56 49.1,27.56 49.4,27.85 49.76,27.85 50.56,28.65 78.44,28.65 78.97,29.18 78.97,36.14 79.5,36.67 SW1.2
RX1_5V: length 76.4
  Top Layer w0.254: U1.26 50.15,25.18 v1(50.14,25.2) ; 75.43,13.32 75.39,13.36
  Top Layer w0.381: USB1.18 75.43,13.32
  Top Layer w0.508: v1(60,12.42) 54.13,12.42 54.08,12.37 ; D2.2 34.32,12.06 34.7,11.68 34.7,6.99 35.15,6.53 v1(53.14,6.53) ; 54.08,12.37 54.08,8.84 53.75,8.51 v1(53.14,8.51) ; 54.08,12.37 54.03,12.42 53.39,12.42 53.03,12.78 53.03,13.56 52.65,13.94 v1(51.87,13.94) ; v1(60.48,13.72) 75.03,13.72 75.39,13.36
  Bottom Layer w0.254: v1(50.14,25.2) 50.16,25.17 50.16,22.63 50.57,22.22 50.57,20.93 51.59,19.91
  Bottom Layer w0.508: v1(51.87,13.94) 51.59,14.22 51.59,19.91 ; v1(53.14,6.53) v1(53.14,8.51) ; v1(60.48,13.72) 60.48,12.9 v1(60,12.42)
RX1_CLK+: length 38.9
  Top Layer w0.254: USB1.10 79.43,14.78 78.91,15.3 59.35,15.3 59.17,15.48 59.17,22.62 58.65,23.14 52.64,23.14 52.6,23.18 U1.22
RX1_CLK-: length 38.9
  Top Layer w0.254: USB1.12 78.46,11.56 78.46,12.91 79.02,13.47 79.02,14.61 78.74,14.89 59.19,14.89 58.77,15.31 58.77,20.07 arc(58.71,20.21) 58.58,20.26 arc(58.45,20.32) 58.39,20.45 58.39,20.58 arc(58.45,20.71) 58.58,20.77 arc(58.71,20.82) 58.77,20.95 58.77,22.45 58.48,22.73 52.64,22.73 52.6,22.68 U1.21
RX1_D0+: length 41.8
  Top Layer w0.254: USB1.7 80.93,12.79 80.85,12.86 80.85,12.94 ; 80.85,12.95 80.85,15.87 80.34,16.38 61,16.38 60.8,16.59 60.8,24.1 60.26,24.64 52.64,24.64 52.6,24.68 U1.25
RX1_D0-: length 41.8
  Top Layer w0.254: USB1.9 79.93,13.08 80.45,13.6 80.45,15.7 80.17,15.98 60.84,15.98 60.39,16.42 60.39,19.95 arc(60.33,20.1) 60.18,20.16 arc(60.03,20.23) 59.97,20.38 59.97,20.46 arc(60.03,20.61) 60.18,20.67 arc(60.33,20.73) 60.39,20.88 60.39,23.94 60.1,24.23 52.64,24.23 52.6,24.18 U1.24
RX1_D1+: length 44.9
  Top Layer w0.254: U1.28 52.6,26.18 52.64,26.14 62.05,26.14 62.58,25.61 62.58,17.81 62.76,17.63 81.86,17.63 82.4,17.08 82.4,11.56 USB1.4
RX1_D1-: length 44.9
  Top Layer w0.254: U1.27 52.6,25.68 52.64,25.73 61.88,25.73 62.17,25.44 62.17,20.95 arc(62.12,20.82) 61.98,20.77 arc(61.85,20.71) 61.8,20.58 61.8,20.45 arc(61.85,20.31) 61.98,20.26 arc(62.12,20.21) 62.17,20.07 62.17,17.64 62.59,17.22 81.69,17.22 81.99,16.92 81.99,13.59 81.38,12.98 81.38,11.57 USB1.6
RX1_D2+: length 47.8
  Top Layer w0.254: USB1.1 83.91,11.54 83.91,17.91 83.28,18.54 64.53,18.54 64.31,18.77 64.31,27.11 63.78,27.64 52.64,27.64 52.6,27.68 U1.31
RX1_D2-: length 47.8
  Top Layer w0.254: U1.30 52.6,27.18 52.64,27.23 63.61,27.23 63.9,26.94 63.9,20.92 arc(63.84,20.79) 63.71,20.74 arc(63.58,20.68) 63.53,20.55 63.53,20.42 arc(63.58,20.28) 63.71,20.23 arc(63.84,20.18) 63.9,20.04 63.9,18.6 64.36,18.14 83.11,18.14 83.51,17.74 83.51,13.69 82.93,13.12 82.93,11.53 USB1.3
RX1_HPD: length 113
  Top Layer w0.254: 77.27,50.26 77.27,48.36 77.7,47.93 88.65,47.93 89.16,47.42 v1(89.16,8.15) ; v1(84.18,8.15) 75.22,8.15 74.93,8.45 USB1.19 74.93,12.63 74.45,13.11 53.9,13.11 53.54,13.46 53.54,19.79 53.26,20.07 50.52,20.07 50.16,20.42 49.98,20.42 ; U1.29 49.34,26.68 49.12,26.47 49.12,20.61 49.31,20.42 49.94,20.42
  Bottom Layer w0.254: v1(89.16,8.15) v1(84.18,8.15)
RX1_SCL: length 52.3
  Top Layer w0.254: USB1.15 76.93,9.63 v1(77.06,9.5) ; U1.3 43.14,20.62 43.01,20.76 v1(43.01,21.31)
  Bottom Layer w0.254: v1(43.01,21.31) 43.14,21.18 43.14,20.76 43.81,20.09 50.4,20.09 50.67,19.82 50.67,13.36 51.15,12.88 53.8,12.88 53.98,12.7 53.98,8.23 54.36,7.84 76.65,7.84 77.14,8.33 77.14,9.41 v1(77.06,9.5)
RX1_SDA: length 50.5
  Top Layer w0.254: USB1.16 76.43,9.63 v1(76.29,9.5) ; U1.4 43.64,20.62 43.77,20.76 v1(43.77,21.31)
  Bottom Layer w0.254: v1(76.29,9.5) 76.29,8.45 76.3,8.45 76.3,8.39 76.1,8.2 54.51,8.2 54.33,8.38 54.33,12.85 53.94,13.24 51.29,13.24 51.03,13.5 51.03,19.96 50.55,20.44 43.96,20.44 43.77,20.63 v1(43.77,21.31)
RX2_5V: length 36.9
  Top Layer w0.381: v1(47.07,23.19) 47.07,23.08 47.14,23 U1.11 ; 41.38,13.64 41.12,13.39 41.14,13.37 USB2.18
  Top Layer w0.508: D3.2 27.53,13.36 27.81,13.64 v1(42.44,13.64)
  Bottom Layer w0.254: 42.87,23.19 42.8,23.19 42.42,22.81 42.42,13.67 v1(42.44,13.64)
  Bottom Layer w0.381: 42.87,23.19 v1(47.07,23.19)
RX2_CLK+: length 7.6
  Top Layer w0.254: U1.7 45.14,17.73 45.1,17.68 45.1,15.77 arc(45.13,15.69) 45.2,15.66 arc(45.28,15.63) 45.31,15.55 45.31,15.26 arc(45.28,15.19) 45.2,15.15 arc(45.13,15.12) 45.1,15.05 45.1,11.57 USB2.10
RX2_CLK-: length 7.6
  Top Layer w0.254: U1.6 44.64,17.73 44.69,17.68 44.69,13.93 44.09,13.33 44.09,11.58 USB2.12
RX2_D0+: length 7.6
  Top Layer w0.254: U1.10 46.64,17.73 46.6,17.68 46.6,15.75 arc(46.63,15.68) 46.7,15.65 arc(46.77,15.62) 46.8,15.54 46.8,15.24 arc(46.77,15.17) 46.7,15.14 arc(46.63,15.11) 46.6,15.04 46.6,11.57 USB2.7
RX2_D0-: length 7.6
  Top Layer w0.254: U1.9 46.14,17.73 46.19,17.68 46.19,13.86 45.59,13.26 45.59,11.58 USB2.9
RX2_D1+: length 7.6
  Top Layer w0.254: USB2.4 48.1,11.57 48.1,15.05 arc(48.13,15.12) 48.2,15.15 arc(48.27,15.18) 48.3,15.25 48.3,15.56 arc(48.27,15.63) 48.2,15.66 arc(48.13,15.69) 48.1,15.76 48.1,17.68 48.14,17.73 U1.13
RX2_D1-: length 7.6
  Top Layer w0.254: USB2.6 47.14,13.28 47.69,13.83 47.69,17.68 47.64,17.73 U1.12
RX2_D2+: length 7.6
  Top Layer w0.254: USB2.1 49.6,11.57 49.6,15.07 arc(49.63,15.14) 49.7,15.17 arc(49.77,15.2) 49.8,15.27 49.8,15.58 arc(49.77,15.65) 49.7,15.68 arc(49.63,15.71) 49.6,15.78 49.6,17.68 49.64,17.73 U1.16
RX2_D2-: length 7.6
  Top Layer w0.254: USB2.3 48.64,13.25 49.19,13.81 49.19,17.68 49.14,17.73 U1.15
RX2_HPD: length 140.3
  Top Layer w0.254: v1(53.59,20.68) 51.45,20.68 U1.17 ; 70.4,50.26 70.4,48.17 71.09,47.47 87.96,47.47 88.44,46.99 88.44,1.93 87.83,1.32 56.08,1.32 55.65,1.75 v1(55.65,9.07) ; USB2.19 40.64,8.15 41.04,7.75 55.62,7.75
  Bottom Layer w0.254: v1(55.65,9.07) 55.65,20.19 55.17,20.68 v1(53.59,20.68)
RX2_SCL: length 27.8
  Top Layer w0.254: USB2.15 42.64,9.96 42.77,9.83 v1(42.77,9.27) ; v1(35.28,18.17) 35.28,18.93 37.54,21.18 U1.63
  Bottom Layer w0.254: v1(42.77,9.27) 42.77,8.12 42.54,7.9 35.66,7.9 35.41,8.15 35.41,17.47 35.28,17.61 v1(35.28,18.17)
RX2_SDA: length 25
  Top Layer w0.254: U1.64 37.74,20.68 36.04,18.98 36.04,18.73 36.04,18.72 v1(36.04,18.17) ; USB2.16 42.14,9.96 42,9.83 v1(42,9.27)
  Bottom Layer w0.254: v1(36.04,18.17) 36.04,17.61 35.91,17.47 35.91,8.51 36.17,8.25 41.85,8.25 42,8.41 v1(42,9.27)
RX3_5V: length 62.2
  Top Layer w0.381: v1(7.01,9.35) 7.01,9.7 6.85,9.87 USB3.18 ; U1.55 v1(41.58,25.18)
  Top Layer w0.762: v1(16.38,17.14) 16.43,17.09 21.58,17.09 ; v1(21.59,17.07) 21.59,17.08 21.58,17.09 ; v1(41.05,17.09) 21.58,17.09 ; D4.2 25.72,12.38 25.35,12.75 21.87,12.75 21.59,13.03 v1(21.59,13.39)
  Bottom Layer w0.381: v1(41.58,25.18) 41.58,17.63 v1(41.05,17.09)
  Bottom Layer w0.762: v1(16.38,17.14) 16.38,9.8 15.93,9.35 v1(7.01,9.35) ; v1(21.59,13.39) v1(21.59,17.07)
RX3_CLK+: length 45.6
  Top Layer w0.254: USB3.10 10.87,11.56 10.87,23.58 11.14,23.85 19.79,23.85 arc(19.93,23.79) 19.99,23.65 arc(20.05,23.5) 20.19,23.44 20.29,23.44 arc(20.44,23.5) 20.5,23.65 arc(20.56,23.79) 20.7,23.85 20.8,23.85 arc(20.95,23.79) 21,23.65 arc(21.06,23.5) 21.21,23.44 21.31,23.44 arc(21.45,23.5) 21.51,23.65 arc(21.57,23.79) 21.72,23.85 30.57,23.85 30.99,24.27 30.99,27.01 31.21,27.23 39.14,27.23 39.19,27.18 U1.51
RX3_CLK-: length 45.6
  Top Layer w0.254: USB3.12 9.84,11.54 9.84,12.87 10.47,13.49 10.47,23.75 10.97,24.25 30.4,24.25 30.58,24.44 30.58,27.18 31.04,27.64 39.14,27.64 39.19,27.68 U1.50
RX3_D0+: length 42.3
  Top Layer w0.254: U1.54 39.19,25.68 39.14,25.73 32.45,25.73 32.23,25.51 32.23,22.89 31.54,22.2 21.99,22.2 arc(21.85,22.14) 21.79,22 arc(21.73,21.85) 21.58,21.79 21.48,21.79 arc(21.34,21.85) 21.28,22 arc(21.22,22.14) 21.08,22.2 20.97,22.2 arc(20.83,22.14) 20.77,22 arc(20.71,21.85) 20.57,21.79 20.47,21.79 arc(20.32,21.85) 20.26,22 arc(20.2,22.14) 20.06,22.2 12.83,22.2 12.35,21.72 USB3.7
RX3_D0-: length 42.3
  Top Layer w0.254: U1.53 39.19,26.18 39.14,26.14 32.28,26.14 31.83,25.68 31.83,23.06 31.37,22.61 12.66,22.61 11.94,21.89 11.94,13.47 11.31,12.84 11.31,11.56 USB3.9
RX3_D1+: length 39.6
  Top Layer w0.254: USB3.4 13.82,11.56 13.82,20.59 14.08,20.85 19.92,20.85 arc(20.07,20.79) 20.13,20.65 arc(20.19,20.51) 20.33,20.45 20.43,20.45 arc(20.57,20.51) 20.63,20.65 arc(20.69,20.79) 20.84,20.85 20.94,20.85 arc(21.08,20.79) 21.14,20.65 arc(21.2,20.51) 21.35,20.45 21.45,20.45 arc(21.59,20.51) 21.65,20.65 arc(21.71,20.79) 21.85,20.85 32.72,20.85 33.32,21.45 33.32,24.05 33.5,24.23 39.14,24.23 39.19,24.18 U1.57
RX3_D1-: length 39.6
  Top Layer w0.254: U1.56 39.19,24.68 39.14,24.64 33.33,24.64 32.92,24.22 32.92,21.62 32.56,21.26 13.91,21.26 13.41,20.76 13.41,13.44 12.81,12.83 12.81,11.57 USB3.6
RX3_D2+: length 36.7
  Top Layer w0.254: USB3.1 15.31,11.56 15.31,18.97 15.49,19.15 19.97,19.15 arc(20.11,19.09) 20.17,18.95 arc(20.23,18.8) 20.38,18.75 20.48,18.75 arc(20.62,18.8) 20.68,18.95 arc(20.74,19.09) 20.88,19.15 20.98,19.15 arc(21.13,19.09) 21.19,18.95 arc(21.25,18.8) 21.39,18.75 21.49,18.75 arc(21.64,18.8) 21.7,18.95 arc(21.76,19.09) 21.9,19.15 34.04,19.15 34.47,19.58 34.47,22.55 34.65,22.73 39.14,22.73 39.19,22.68 U1.60
RX3_D2-: length 36.7
  Top Layer w0.254: USB3.3 14.3,11.57 14.3,12.83 14.91,13.44 14.91,19.14 15.33,19.56 33.87,19.56 34.06,19.75 34.06,22.72 34.48,23.14 39.14,23.14 39.19,23.18 U1.59
RX3_HPD: length 189
  Top Layer w0.254: 32.54,7.52 v1(32.54,7.93) ; 32.54,7.52 32.28,7.78 6.6,7.78 6.35,8.03 USB3.19 ; 32.54,7.52 32.54,2.62 32.84,2.31 v1(54.18,2.31) ; v1(32.59,15.88) 37.19,15.88 v1(37.21,15.9) ; 63.52,50.26 63.52,47.83 64.31,47.04 87.45,47.04 87.71,46.79 87.71,2.72 87.32,2.34 56.82,2.34 v1(56.79,2.31) ; U1.58 40.36,23.7 v1(42.4,23.7)
  Bottom Layer w0.254: v1(32.54,7.93) 32.54,15.82 v1(32.59,15.88) ; v1(42.4,23.7) 42.06,23.36 42.06,16.31 41.66,15.9 v1(37.21,15.9) ; v1(56.79,2.31) v1(54.18,2.31)
RX3_SCL: length 46
  Top Layer w0.254: U1.1 42.14,15.04 41.76,14.66 20.65,14.66 20.19,14.2 20.19,8.99 19.94,8.74 8.58,8.74 8.35,8.98 USB3.15
RX3_SDA: length 47.7
  Top Layer w0.254: USB3.16 7.85,8.53 8.1,8.28 20.34,8.28 20.73,8.67 20.73,13.9 20.98,14.16 41.99,14.16 42.64,14.8 U1.2
SCL: length 80.6
  Top Layer w0.254: U1.18 52.75,21.18 52.9,21.33 55.22,21.33 55.4,21.15 55.4,14.32 55.87,13.84 v1(57.86,13.84) ; v1(75.24,20.37) 84.66,20.37 85.32,19.71 85.32,7.82 84.56,7.06 59.06,7.06 58.57,7.55 58.57,9.19 v1(58.6,9.22) ; R7.1 68.82,22.05 H1.2 68.83,22.04 v1(68.83,20.32)
  Bottom Layer w0.254: v1(58.6,9.22) 58.62,9.24 58.62,13.53 58.31,13.84 v1(57.86,13.84) ; v1(68.83,20.32) 68.89,20.37 v1(75.24,20.37)
SDA: length 76.8
  Top Layer w0.254: v1(59.36,9.22) 59.39,9.19 59.39,7.67 59.64,7.42 84.42,7.42 84.96,7.97 84.96,19.2 84.4,19.76 71.78,19.76 71.37,20.17 H1.1 71.37,23.83 71.36,23.83 R8.1 ; U1.19 55.37,21.68 55.75,21.3 55.75,14.78 55.94,14.6 v1(57.86,14.6)
  Bottom Layer w0.254: v1(59.36,9.22) 59.36,14.21 58.97,14.6 v1(57.86,14.6)
TX_CLK+: length 75
  Top Layer w0.254: U1.44 44.14,31.14 44.1,31.19 44.1,37.65 43.54,38.2 39.57,38.2 arc(39.47,38.24) 39.43,38.34 arc(39.39,38.44) 39.29,38.48 39.06,38.48 arc(38.96,38.44) 38.92,38.34 arc(38.88,38.24) 38.78,38.2 38.56,38.2 arc(38.46,38.24) 38.42,38.34 arc(38.37,38.44) 38.28,38.48 38.05,38.48 arc(37.95,38.44) 37.91,38.34 arc(37.87,38.24) 37.77,38.2 37.54,38.2 arc(37.44,38.24) 37.4,38.34 arc(37.36,38.44) 37.26,38.48 37.03,38.48 arc(36.93,38.44) 36.89,38.34 arc(36.85,38.24) 36.75,38.2 36.52,38.2 arc(36.42,38.24) 36.38,38.34 arc(36.34,38.44) 36.24,38.48 36.01,38.48 arc(35.92,38.44) 35.88,38.34 arc(35.83,38.24) 35.74,38.2 35.51,38.2 arc(35.41,38.24) 35.37,38.34 arc(35.33,38.44) 35.23,38.48 35,38.48 arc(34.9,38.44) 34.86,38.34 arc(34.82,38.24) 34.72,38.2 26.51,38.2 26.21,38.5 26.21,57.73 26.47,57.99 44.83,57.99 45.15,57.67 45.15,48.6 45.18,48.57
TX_CLK-: length 75
  Top Layer w0.254: 46.18,48.57 46.11,48.64 46.11,49.99 45.56,50.54 45.56,57.84 45,58.39 26.3,58.39 25.81,57.9 25.81,38.33 26.34,37.8 43.38,37.8 43.69,37.48 43.69,31.19 43.64,31.14 U1.45
TX_D0+: length 70
  Top Layer w0.254: U1.41 45.64,31.14 45.6,31.19 45.6,39.48 45.03,40.05 40.44,40.05 arc(40.35,40.08) 40.32,40.17 arc(40.28,40.25) 40.2,40.28 39.93,40.28 arc(39.85,40.25) 39.81,40.17 arc(39.78,40.08) 39.69,40.05 39.42,40.05 arc(39.34,40.08) 39.3,40.17 arc(39.27,40.25) 39.19,40.28 38.91,40.28 arc(38.83,40.25) 38.8,40.17 arc(38.76,40.08) 38.68,40.05 38.41,40.05 arc(38.32,40.08) 38.29,40.17 arc(38.25,40.25) 38.17,40.28 37.9,40.28 arc(37.81,40.25) 37.78,40.17 arc(37.74,40.08) 37.66,40.05 37.39,40.05 arc(37.31,40.08) 37.27,40.17 arc(37.24,40.25) 37.15,40.28 36.88,40.28 arc(36.8,40.25) 36.76,40.17 arc(36.73,40.08) 36.65,40.05 36.37,40.05 arc(36.29,40.08) 36.26,40.17 arc(36.22,40.25) 36.14,40.28 35.87,40.28 arc(35.78,40.25) 35.75,40.17 arc(35.71,40.08) 35.63,40.05 35.36,40.05 arc(35.27,40.08) 35.24,40.17 arc(35.2,40.25) 35.12,40.28 34.85,40.28 arc(34.77,40.25) 34.73,40.17 arc(34.7,40.08) 34.61,40.05 27.92,40.05 27.61,40.36 27.61,56.53 27.9,56.82 43.46,56.82 43.71,56.57 43.71,48.61 USB4.7
TX_D0-: length 70
  Top Layer w0.254: USB4.9 44.75,48.64 44.75,49.84 44.12,50.47 44.12,56.73 43.63,57.23 27.73,57.23 27.2,56.69 27.2,40.19 27.75,39.64 44.86,39.64 45.19,39.32 45.19,31.19 45.14,31.14 U1.42
TX_D1+: length 55.5
  Top Layer w0.254: U1.39 46.64,31.14 46.6,31.19 46.6,41.79 46.02,42.37 39.63,42.37 arc(39.53,42.41) 39.49,42.51 arc(39.45,42.61) 39.35,42.65 39.12,42.65 arc(39.02,42.61) 38.98,42.51 arc(38.94,42.41) 38.84,42.37 38.62,42.37 arc(38.52,42.41) 38.48,42.51 arc(38.43,42.61) 38.34,42.65 38.11,42.65 arc(38.01,42.61) 37.97,42.51 arc(37.93,42.41) 37.83,42.37 37.6,42.37 arc(37.5,42.41) 37.46,42.51 arc(37.42,42.61) 37.32,42.65 37.09,42.65 arc(36.99,42.61) 36.95,42.51 arc(36.91,42.41) 36.81,42.37 36.58,42.37 arc(36.48,42.41) 36.44,42.51 arc(36.4,42.61) 36.3,42.65 36.07,42.65 arc(35.98,42.61) 35.94,42.51 arc(35.89,42.41) 35.8,42.37 35.57,42.37 arc(35.47,42.41) 35.43,42.51 arc(35.39,42.61) 35.29,42.65 35.06,42.65 arc(34.96,42.61) 34.92,42.51 arc(34.88,42.41) 34.78,42.37 31.26,42.37 30.84,42.79 30.84,52.86 31.09,53.11 41.92,53.11 42.18,52.86 42.18,48.57
TX_D1-: length 55.5
  Top Layer w0.254: 43.18,48.57 43.18,49.91 42.58,50.51 42.58,53.03 42.09,53.52 30.92,53.52 30.41,53.01 30.41,42.64 31.09,41.96 45.85,41.96 46.19,41.62 46.19,31.19 46.14,31.14 U1.40
TX_D2+: length 49.2
  Top Layer w0.254: U1.36 48.14,31.14 48.1,31.19 48.1,43.42 47.58,43.93 37.86,43.93 arc(37.7,44) 37.63,44.17 arc(37.56,44.33) 37.4,44.4 37.35,44.4 arc(37.19,44.33) 37.12,44.17 arc(37.05,44) 36.89,43.93 36.85,43.93 arc(36.68,44) 36.61,44.17 arc(36.55,44.33) 36.38,44.4 36.34,44.4 arc(36.17,44.33) 36.11,44.17 arc(36.04,44) 35.87,43.93 35.83,43.93 arc(35.67,44) 35.6,44.17 arc(35.53,44.33) 35.37,44.4 35.32,44.4 arc(35.16,44.33) 35.09,44.17 arc(35.02,44) 34.86,43.93 32.92,43.93 32.64,44.22 32.64,51.34 33.01,51.71 40.46,51.71 40.67,51.5 40.67,48.58 USB4.1
TX_D2-: length 49.2
  Top Layer w0.254: USB4.3 41.68,49.91 41.08,50.51 41.08,51.67 40.63,52.12 32.84,52.12 32.23,51.51 32.23,44.05 32.75,43.53 47.41,43.53 47.69,43.25 47.69,31.19 47.64,31.14 U1.37
TX_HPD: length 31.2
  Top Layer w0.254: v1(49.76,27.27) 49.64,27.15 42.9,27.15 42.64,27.41 U1.47 ; USB4.19 49.68,48.56 v1(49.68,46.56)
  Bottom Layer w0.254: v1(49.76,27.27) 49.76,46.48 v1(49.68,46.56)
TX_SCL: length 43.7
  Top Layer w0.254: U1.61 42.25,22.18 42.57,22.5 v1(44.81,22.5) ; USB4.15 47.68,46.95 47.47,46.74 v1(47.47,46.54) 47.42,46.49 47.42,44.7 47.72,44.41 52.97,44.41 R15.2
  Bottom Layer w0.254: v1(47.47,46.54) 47.4,46.46 47.4,44.92 48.64,43.68 48.64,22.66 48.48,22.5 v1(44.81,22.5)
TX_SDA: length 42.4
  Top Layer w0.254: R14.2 48.59,45.27 48.24,45.62 48.24,46.53 v1(48.23,46.54) 48.23,46.74 48.18,46.8 48.18,48.57 ; U1.62 42.46,21.68 42.7,21.93 43.99,21.93 44.17,21.74 v1(44.81,21.74)
  Bottom Layer w0.254: v1(44.81,21.74) 44.99,21.92 48.59,21.92 49.14,22.47 49.14,43.72 48.23,44.63 v1(48.23,46.54)
$1N1487: length 7.8
  Top Layer w0.254: U1.14 48.64,19.92 48.79,20.07 49.94,20.07 50.12,19.89 50.12,19.14 50.37,18.88 R1.2 R2.2
$1N1687: length 15.9
  Top Layer w0.254: U1.38 47.14,28.17 47.32,27.99 48.53,27.99 48.78,28.25 49.35,28.25 50.5,29.4 54.3,29.4 54.45,29.55 R4.2 R3.1
$1N4048: length 2.8
  Top Layer w0.254: R5.2 10.28,30.96 9.63,30.96 9.22,30.56 USB5.B5
$1N4076: length 2.6
  Top Layer w0.254: R6.2 10.16,33.56 USB5.A5
$1N4174: length 15.8
  Top Layer w0.254: USB5.A4 12.88,34.86 13.1,34.63 D1.2 12.35,29.77 12.34,29.76 USB5.A9
$1N5209: length 5.3
  Top Layer w0.254: SW1.1 80.5,27.52 C11.1 77.96,27.5 77.95,27.49
$1N5577: length 2
  Top Layer w0.254: LED1.2 77.26,51.78 R10.2
$1N5615: length 2
  Top Layer w0.254: LED3.2 63.51,51.78 R12.2
$1N5620: length 2
  Top Layer w0.254: LED2.2 70.38,53.09 70.4,53.08 R11.2
$1N6792: length 10
  Top Layer w0.254: 49.3,50.5 49.18,50.37 49.18,48.57
  Top Layer w0.762: R13.2 53.65,47.07 50.93,47.07 50.39,47.61 50.39,50.57 50.07,50.89 49.62,50.89 49.3,50.57 49.3,50.5

## Copper pours and planes (outline as drawn; the poured copper is in the pictures)
1.8V on Top Layer: 48.46,32.28 48.84,32.28 48.84,29.16 48.46,29.16
3.3V on Top Layer: 38.25,31.27 41.23,31.27 41.23,28.07 38.25,28.07
+5V on Top Layer: 41.5,32.66 42.29,32.66 42.29,29.11 41.5,29.11
GND on Top Layer: -2.57,62.13 93.32,62.13 93.32,-2.9 -2.57,-2.9
GND on Bottom Layer: -6.38,64.69 98.83,64.69 98.83,-6.68 -6.38,-6.68
$1N4174 on Top Layer: 7.04,30.21 12.62,30.21 12.62,29.41 7.04,29.41
$1N4174 on Top Layer: 7.04,35.01 13.23,35.01 13.23,34.42 7.04,34.42
$1N4174 on Top Layer: 12.6,35 13.59,35 13.59,30.1 12.6,30.1

Small or netless copper shapes (teardrops, artwork), in the pictures only: 279 on Top Layer, 67 on Bottom Layer
